# EAGLE design 01 Raspberry Hat 7 Schematic (EAGLE 9.1.1)

## Sheet 1 of 8: Motor controllers
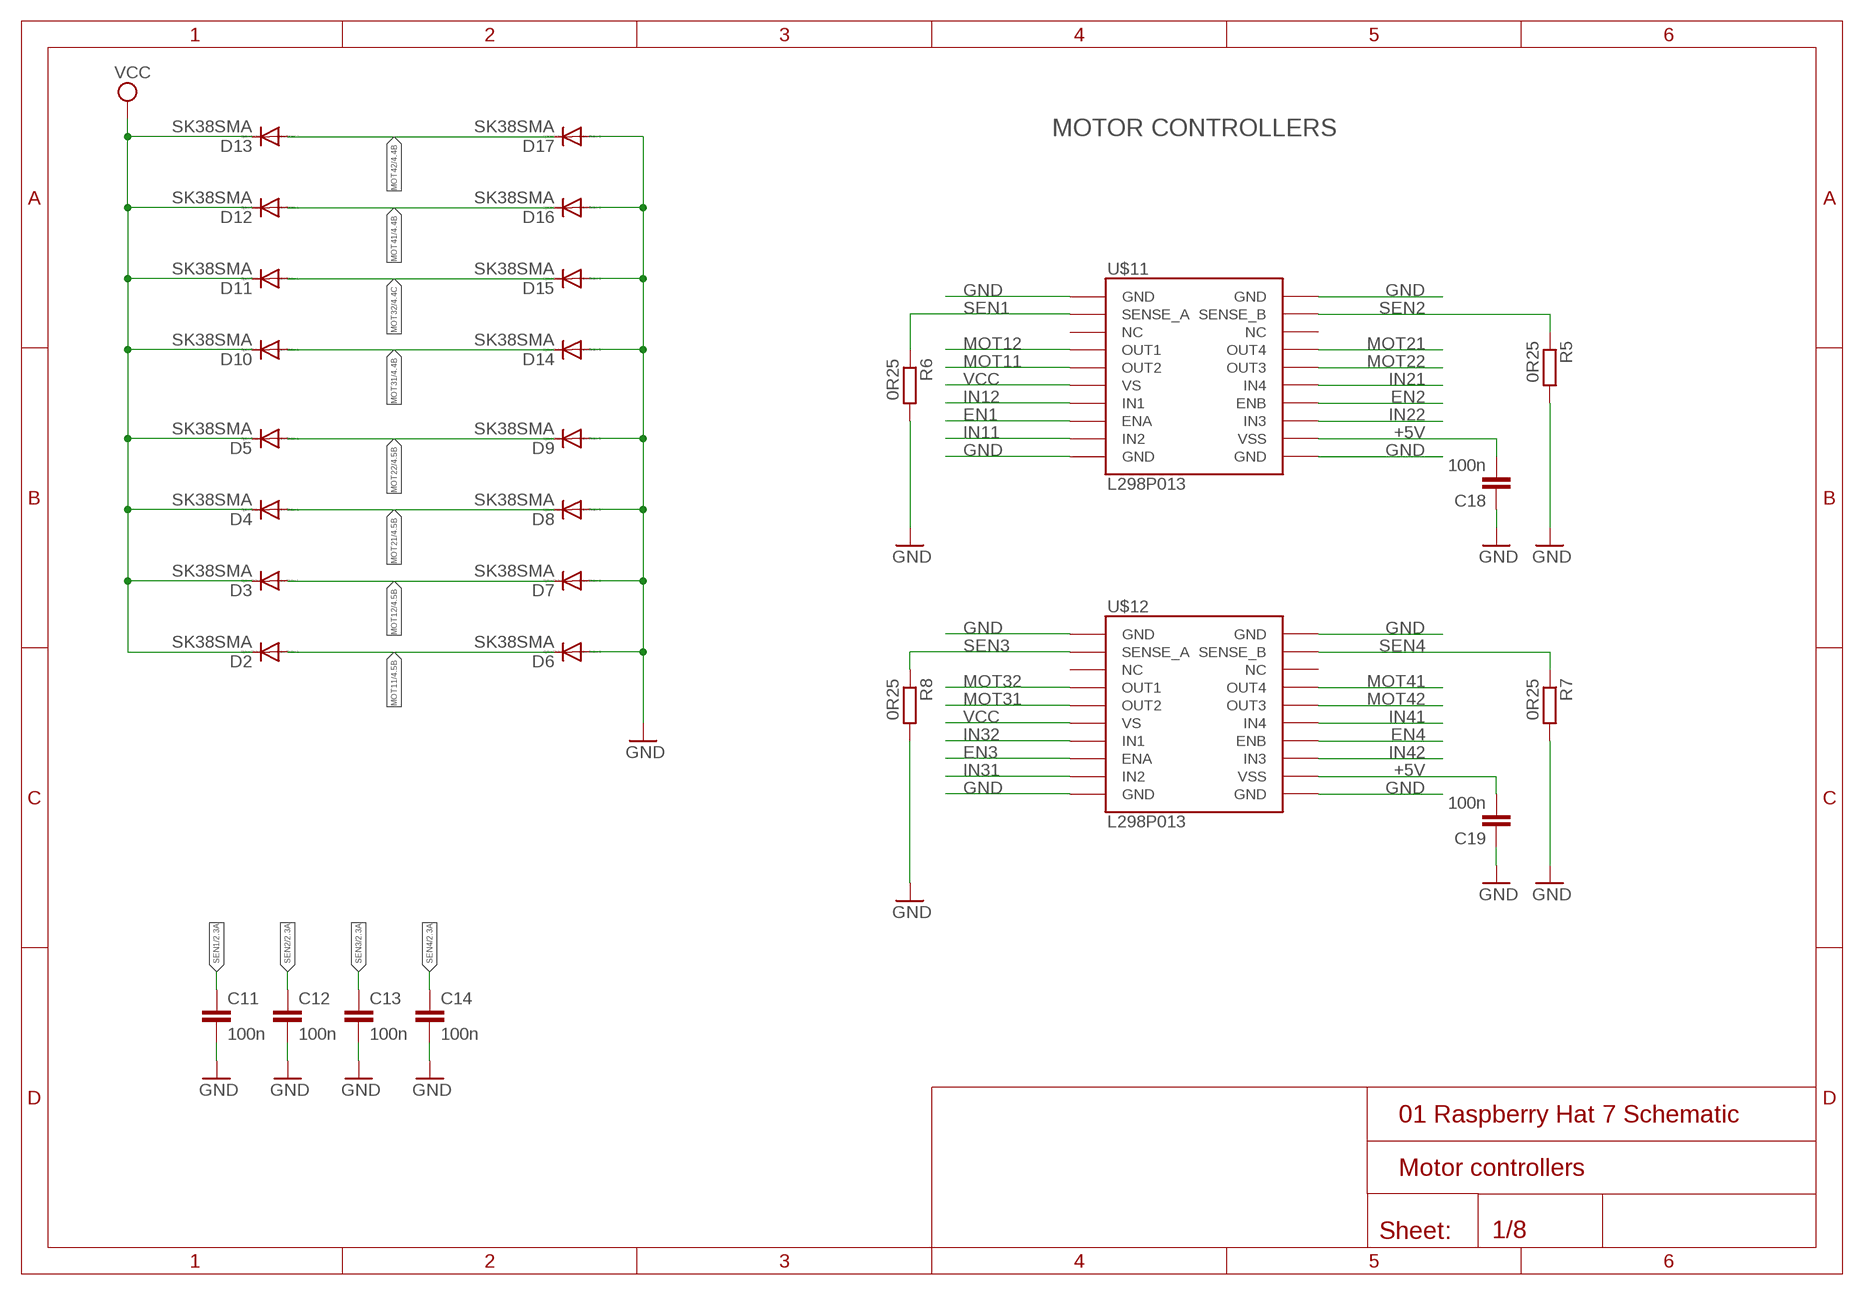
[diagram p0: schematic, sheet 1]

### Parts
C11  100n  C-EUC0603K  [C0603K]
C12  100n  C-EUC0603K  [C0603K]
C13  100n  C-EUC0603K  [C0603K]
C14  100n  C-EUC0603K  [C0603K]
C18  100n  C-EUC0603K  [C0603K]
C19  100n  C-EUC0603K  [C0603K]
D2  SK38SMA  DIODE-SOD123  [SOD123]
D3  SK38SMA  DIODE-SOD123  [SOD123]
D4  SK38SMA  DIODE-SOD123  [SOD123]
D5  SK38SMA  DIODE-SOD123  [SOD123]
D6  SK38SMA  DIODE-SOD123  [SOD123]
D7  SK38SMA  DIODE-SOD123  [SOD123]
D8  SK38SMA  DIODE-SOD123  [SOD123]
D9  SK38SMA  DIODE-SOD123  [SOD123]
D10  SK38SMA  DIODE-SOD123  [SOD123]
D11  SK38SMA  DIODE-SOD123  [SOD123]
D12  SK38SMA  DIODE-SOD123  [SOD123]
D13  SK38SMA  DIODE-SOD123  [SOD123]
D14  SK38SMA  DIODE-SOD123  [SOD123]
D15  SK38SMA  DIODE-SOD123  [SOD123]
D16  SK38SMA  DIODE-SOD123  [SOD123]
D17  SK38SMA  DIODE-SOD123  [SOD123]
R5  0R25  R-EU_R2512  [R2512]
R6  0R25  R-EU_R2512  [R2512]
R7  0R25  R-EU_R2512  [R2512]
R8  0R25  R-EU_R2512  [R2512]
U$11  L298P013  L298_BRIDGE_DRIVER  [POWERSO20]
U$12  L298P013  L298_BRIDGE_DRIVER  [POWERSO20]

### Nets
+5V: C18.2 C19.2 U$11.12(VSS) U$12.12(VSS) ; also sheet 3,4,5,6
EN1: U$11.8(ENA) ; also sheet 5
EN2: U$11.14(ENB) ; also sheet 5
EN3: U$12.8(ENA) ; also sheet 5
EN4: U$12.14(ENB) ; also sheet 5
GND: C11.2 C12.2 C13.2 C14.2 C18.1 C19.1 D6.A D7.A D8.A D9.A D14.A D15.A D16.A D17.A R5.2 R6.2 R7.2 R8.2 U$11.1(GND) U$11.10(GND) U$11.11(GND) U$11.20(GND) U$12.1(GND) U$12.10(GND) U$12.11(GND) U$12.20(GND) ; also sheet 2,3,4,5,6,7
IN11: U$11.9(IN2) ; also sheet 5
IN12: U$11.7(IN1) ; also sheet 5
IN21: U$11.15(IN4) ; also sheet 5
IN22: U$11.13(IN3) ; also sheet 5
IN31: U$12.9(IN2) ; also sheet 5
IN32: U$12.7(IN1) ; also sheet 5
IN41: U$12.15(IN4) ; also sheet 5
IN42: U$12.13(IN3) ; also sheet 5
MOT11: D2.A D6.C U$11.5(OUT2) ; also sheet 4
MOT12: D3.A D7.C U$11.4(OUT1) ; also sheet 4
MOT21: D4.A D8.C U$11.17(OUT4) ; also sheet 4
MOT22: D5.A D9.C U$11.16(OUT3) ; also sheet 4
MOT31: D10.A D14.C U$12.5(OUT2) ; also sheet 4
MOT32: D11.A D15.C U$12.4(OUT1) ; also sheet 4
MOT41: D12.A D16.C U$12.17(OUT4) ; also sheet 4
MOT42: D13.A D17.C U$12.16(OUT3) ; also sheet 4
SEN1: C11.1 R6.1 U$11.2(SENSE_A) ; also sheet 2
SEN2: C12.1 R5.1 U$11.19(SENSE_B) ; also sheet 2
SEN3: C13.1 R8.1 U$12.2(SENSE_A) ; also sheet 2
SEN4: C14.1 R7.1 U$12.19(SENSE_B) ; also sheet 2
VCC: D2.C D3.C D4.C D5.C D10.C D11.C D12.C D13.C U$11.6(VS) U$12.6(VS) ; also sheet 3,4
Unconnected: U$11.3(NC) U$11.18(NC) U$12.3(NC) U$12.18(NC)

### Notes on the sheet
- MOTOR CONTROLLERS

## Sheet 2 of 8: Microcontroller connections
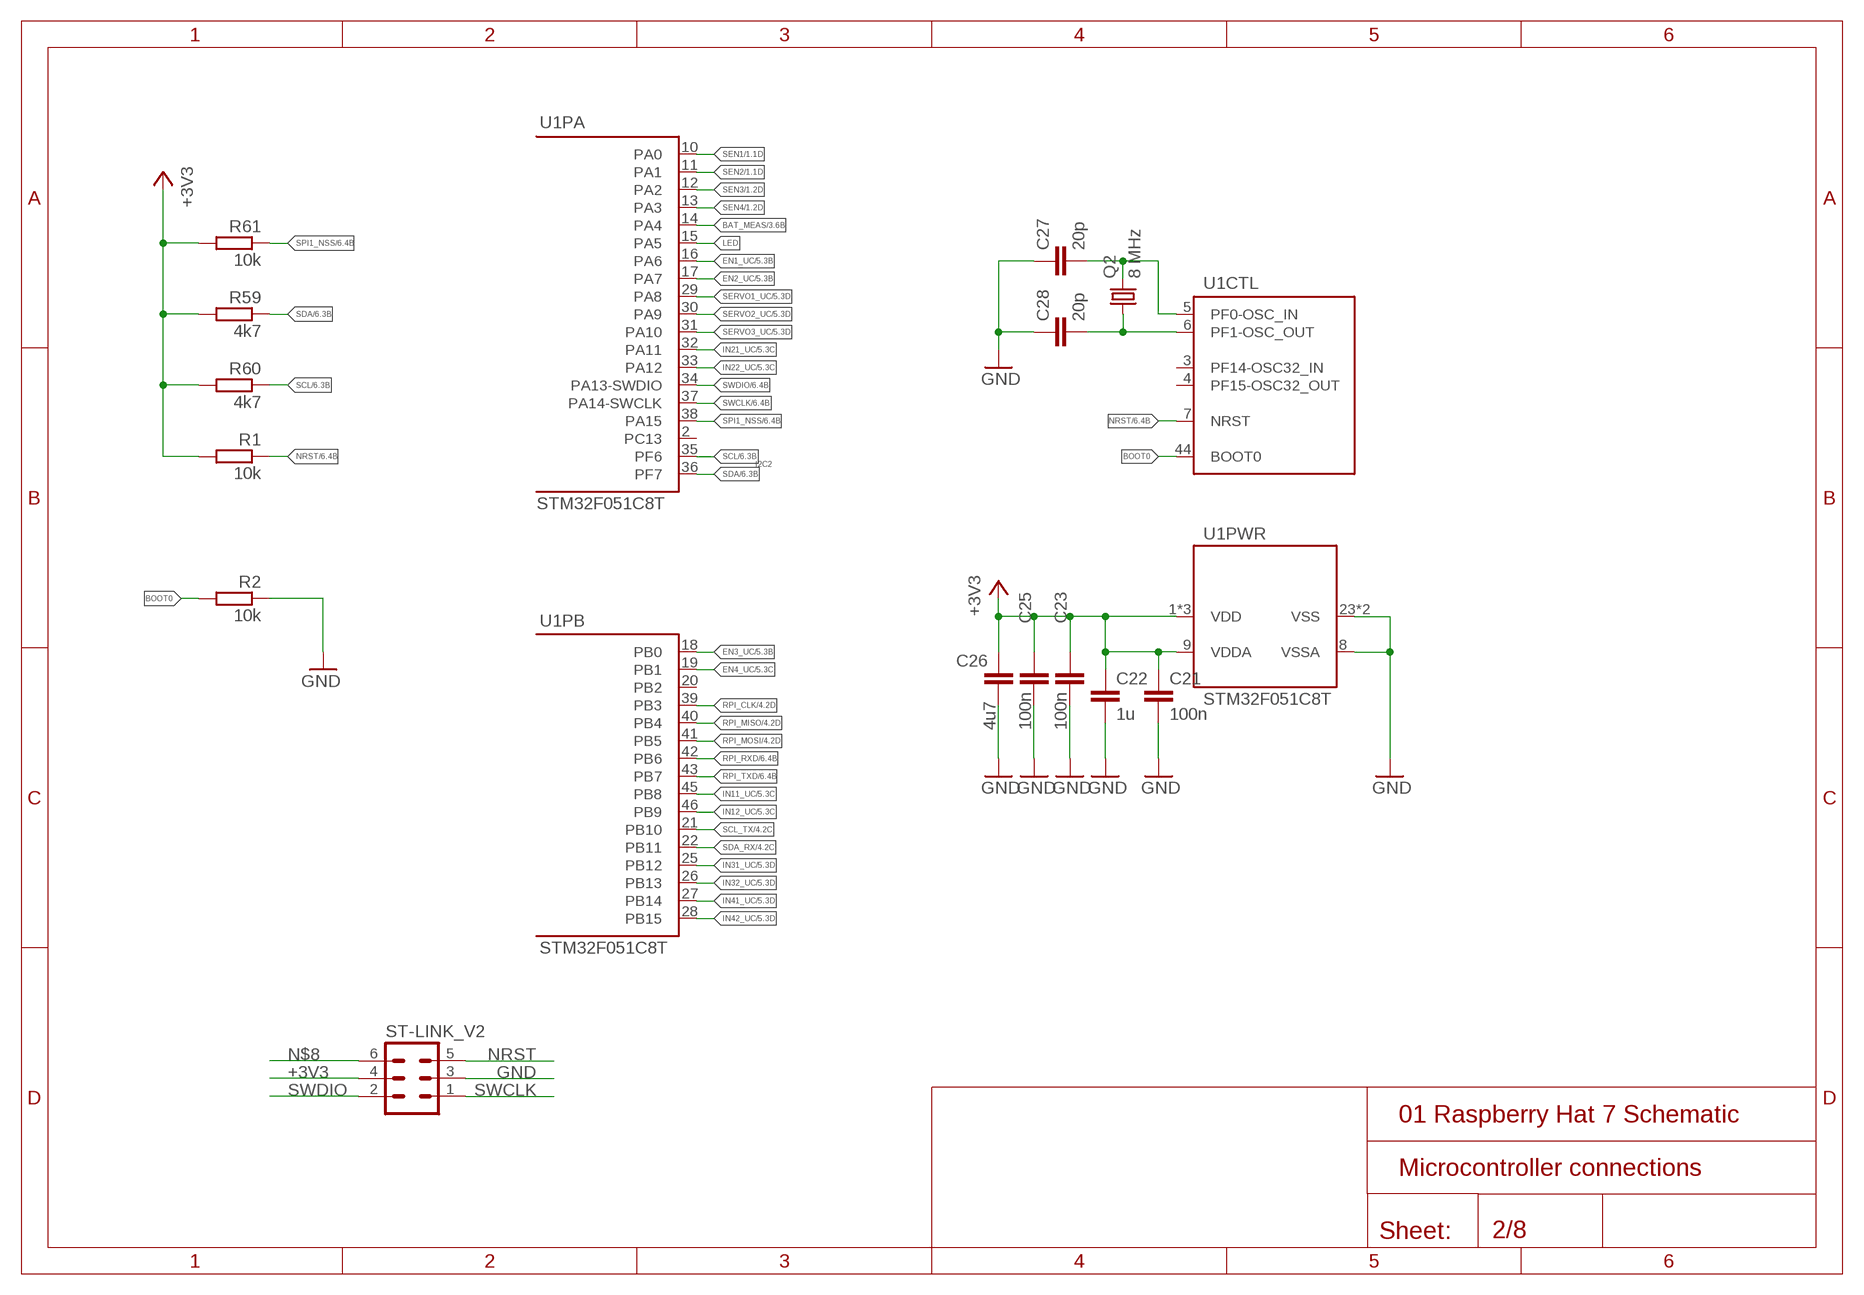
[diagram p1: schematic, sheet 2]

### Parts
C21  100n  C-EUC0603K  [C0603K]
C22  1u  C-EUC0603K  [C0603K]
C23  100n  C-EUC0603K  [C0603K]
C25  100n  C-EUC0603K  [C0603K]
C26  4u7  C-EUC0603K  [C0603K]
C27  20p  C-EUC0603K  [C0603K]
C28  20p  C-EUC0603K  [C0603K]
Q2  8 MHz  CRYSTALHC49UP  [HC49UP]
R1  10k  R-EU_R0603  [R0603]
R2  10k  R-EU_R0603  [R0603]
R59  4k7  R-EU_R0603  [R0603]
R60  4k7  R-EU_R0603  [R0603]
R61  10k  R-EU_R0603  [R0603]
ST-LINK_V2  ML6  [ML6]
U1  STM32F051C8T  [LQFP48]

### Nets
+3V3: C21.1 C22.1 C23.1 C25.1 C26.1 R1.2 R59.2 R60.2 R61.2 ST-LINK_V2.4 U1.1(PWR:VDD) U1.9(PWR:VDDA) U1.24(PWR:VDD) U1.48(PWR:VDD) ; also sheet 5,6,7
BAT_MEAS: U1.14(PA:PA4) ; also sheet 3
BOOT0: R2.2 U1.44(CTL:BOOT0)
EN1_UC: U1.16(PA:PA6) ; also sheet 5
EN2_UC: U1.17(PA:PA7) ; also sheet 5
EN3_UC: U1.18(PB:PB0) ; also sheet 5
EN4_UC: U1.19(PB:PB1) ; also sheet 5
GND: C21.2 C22.2 C23.2 C25.2 C26.2 C27.1 C28.1 R2.1 ST-LINK_V2.3 U1.8(PWR:VSSA) U1.23(PWR:VSS) U1.47(PWR:VSS) ; also sheet 1,3,4,5,6,7
IN11_UC: U1.45(PB:PB8) ; also sheet 5
IN12_UC: U1.46(PB:PB9) ; also sheet 5
IN21_UC: U1.32(PA:PA11) ; also sheet 5
IN22_UC: U1.33(PA:PA12) ; also sheet 5
IN31_UC: U1.25(PB:PB12) ; also sheet 5
IN32_UC: U1.26(PB:PB13) ; also sheet 5
IN41_UC: U1.27(PB:PB14) ; also sheet 5
IN42_UC: U1.28(PB:PB15) ; also sheet 5
LED: U1.15(PA:PA5)
N$8: ST-LINK_V2.6
N$28: C28.2 Q2.1 U1.6(CTL:PF1-OSC_OUT)
N$29: C27.2 Q2.2 U1.5(CTL:PF0-OSC_IN)
NRST: R1.1 ST-LINK_V2.5 U1.7(CTL:NRST) ; also sheet 6
RPI_CLK: U1.39(PB:PB3) ; also sheet 4,6
RPI_MISO: U1.40(PB:PB4) ; also sheet 4,6
RPI_MOSI: U1.41(PB:PB5) ; also sheet 4,6
RPI_RXD: U1.42(PB:PB6) ; also sheet 6
RPI_TXD: U1.43(PB:PB7) ; also sheet 6
SCL: R60.1 U1.35(PA:PF6) ; also sheet 6,7
SCL_TX: U1.21(PB:PB10) ; also sheet 4
SDA: R59.1 U1.36(PA:PF7) ; also sheet 6,7
SDA_RX: U1.22(PB:PB11) ; also sheet 4
SEN1: U1.10(PA:PA0) ; also sheet 1
SEN2: U1.11(PA:PA1) ; also sheet 1
SEN3: U1.12(PA:PA2) ; also sheet 1
SEN4: U1.13(PA:PA3) ; also sheet 1
SERVO1_UC: U1.29(PA:PA8) ; also sheet 5
SERVO2_UC: U1.30(PA:PA9) ; also sheet 5
SERVO3_UC: U1.31(PA:PA10) ; also sheet 5
SPI1_NSS: R61.1 U1.38(PA:PA15) ; also sheet 6
SWCLK: ST-LINK_V2.1 U1.37(PA:PA14-SWCLK) ; also sheet 6
SWDIO: ST-LINK_V2.2 U1.34(PA:PA13-SWDIO) ; also sheet 6
Unconnected: U1.2(PA:PC13) U1.3(CTL:PF14-OSC32_IN) U1.4(CTL:PF15-OSC32_OUT) U1.20(PB:PB2)

### Notes on the sheet
- I2C2

## Sheet 3 of 8: Power supply
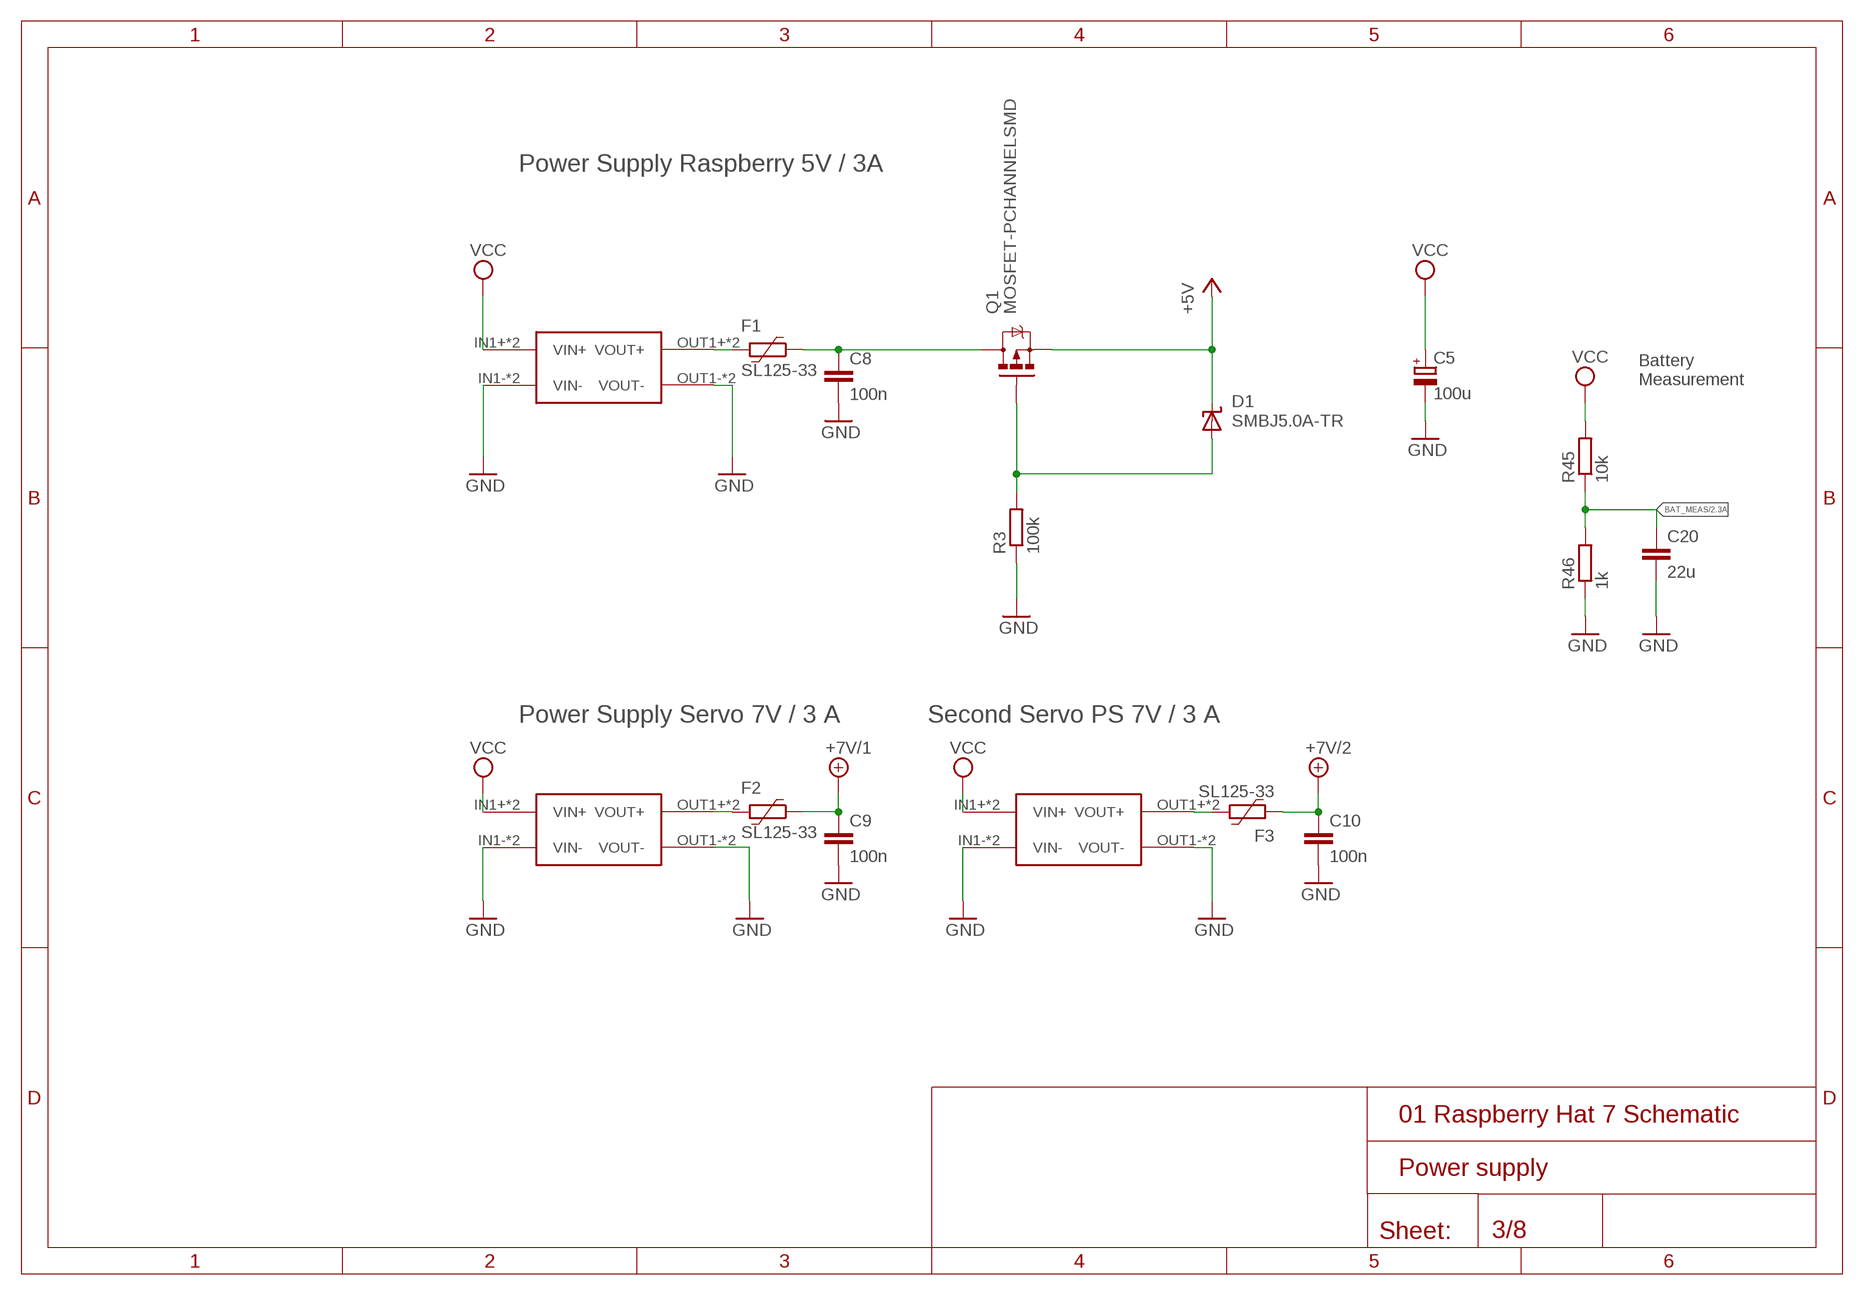
[diagram p2: schematic, sheet 3]

### Parts
C5  100u  CPOL-EU153CLV-0807  [153CLV-0807]
C8  100n  C-EUC0603K  [C0603K]
C9  100n  C-EUC0603K  [C0603K]
C10  100n  C-EUC0603K  [C0603K]
C20  22u  C-EUC0603K  [C0603K]
D1  SMBJ5.0A-TR  SUPPRESSOR-SMBJ  [SMBJ]
F1  SL125-33  2920L050  [2920L]
F2  SL125-33  2920L050  [2920L]
F3  SL125-33  2920L050  [2920L]
Q1  MOSFET-PCHANNELSMD  [SOT23-3]
R3  100k  R-EU_R0603  [R0603]
R45  10k  R-EU_R0603  [R0603]
R46  1k  R-EU_R0603  [R0603]
U$1  MP1584  [DC-BRICK]
U$2  MP1584  [DC-BRICK]
U$3  MP1584  [DC-BRICK]

### Nets
5V_NOT_TRIMMED: C8.1 F1.1 Q1.3(D)
+5V: D1.C Q1.2(S) ; also sheet 1,4,5,6
+5V_RAW: F1.2 U$3.OUT1+(VOUT+) U$3.OUT2+(VOUT+)
+7V/1: C9.1 F2.1 ; also sheet 4
+7V/1_RAW: F2.2 U$2.OUT1+(VOUT+) U$2.OUT2+(VOUT+)
+7V/2: C10.1 F3.2 ; also sheet 4
+7V/2_RAW: F3.1 U$1.OUT1+(VOUT+) U$1.OUT2+(VOUT+)
BAT_MEAS: C20.1 R45.1 R46.2 ; also sheet 2
D1-R3: D1.A Q1.1(G) R3.2
GND: C5.- C8.2 C9.2 C10.2 C20.2 R3.1 R46.1 U$1.IN1-(VIN-) U$1.IN2-(VIN-) U$1.OUT1-(VOUT-) U$1.OUT2-(VOUT-) U$2.IN1-(VIN-) U$2.IN2-(VIN-) U$2.OUT1-(VOUT-) U$2.OUT2-(VOUT-) U$3.IN1-(VIN-) U$3.IN2-(VIN-) U$3.OUT1-(VOUT-) U$3.OUT2-(VOUT-) ; also sheet 1,2,4,5,6,7
VCC: C5.+ R45.2 U$1.IN1+(VIN+) U$1.IN2+(VIN+) U$2.IN1+(VIN+) U$2.IN2+(VIN+) U$3.IN1+(VIN+) U$3.IN2+(VIN+) ; also sheet 1,4

### Notes on the sheet
- Power Supply Raspberry 5V / 3A
- Battery
  Measurement
- Power Supply Servo 7V / 3 A | Second Servo PS 7V / 3 A

## Sheet 4 of 8: Connectors
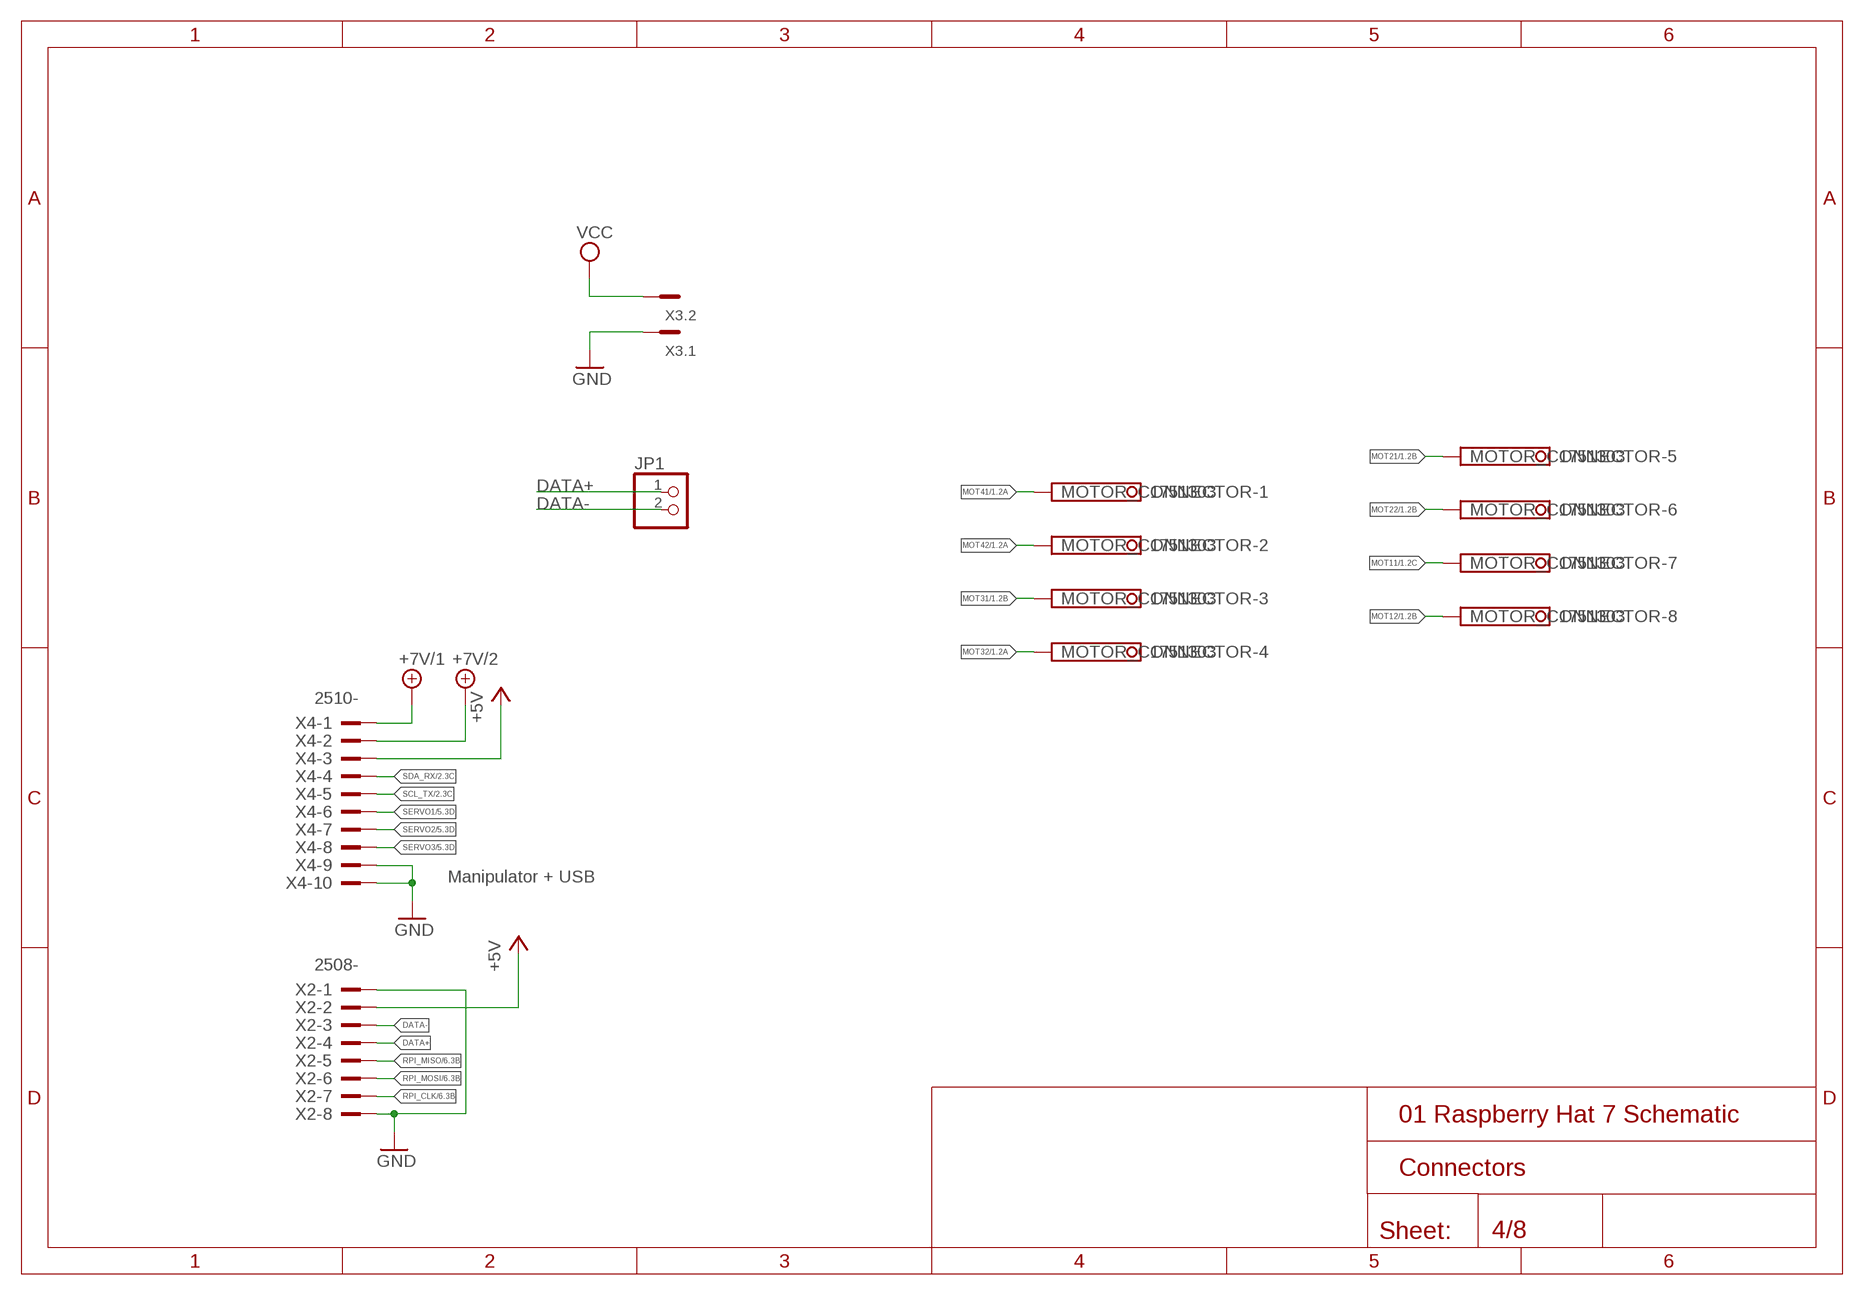
[diagram p3: schematic, sheet 4]

### Parts
JP1  PINHD-1X2  [1X02]
MOTOR_CONNECTOR  1751303  [1751303]
X2  2508-  [PAK100/2500-10]
X3  MC2  [MC2]
X4  2510-  [PAK100/2500-10]

### Nets
+5V: X2.2 X4.3 ; also sheet 1,3,5,6
+7V/1: X4.1 ; also sheet 3
+7V/2: X4.2 ; also sheet 3
DATA+: JP1.1 X2.4
DATA-: JP1.2 X2.3
GND: X2.1 X2.8 X3.1 X4.9 X4.10 ; also sheet 1,2,3,5,6,7
MOT11: MOTOR_CONNECTOR.7 ; also sheet 1
MOT12: MOTOR_CONNECTOR.8 ; also sheet 1
MOT21: MOTOR_CONNECTOR.5 ; also sheet 1
MOT22: MOTOR_CONNECTOR.6 ; also sheet 1
MOT31: MOTOR_CONNECTOR.3 ; also sheet 1
MOT32: MOTOR_CONNECTOR.4 ; also sheet 1
MOT41: MOTOR_CONNECTOR.1 ; also sheet 1
MOT42: MOTOR_CONNECTOR.2 ; also sheet 1
RPI_CLK: X2.7 ; also sheet 2,6
RPI_MISO: X2.5 ; also sheet 2,6
RPI_MOSI: X2.6 ; also sheet 2,6
SCL_TX: X4.5 ; also sheet 2
SDA_RX: X4.4 ; also sheet 2
SERVO1: X4.6 ; also sheet 5
SERVO2: X4.7 ; also sheet 5
SERVO3: X4.8 ; also sheet 5
VCC: X3.2 ; also sheet 1,3

### Notes on the sheet
- Manipulator + USB

## Sheet 5 of 8: Voltage level translators
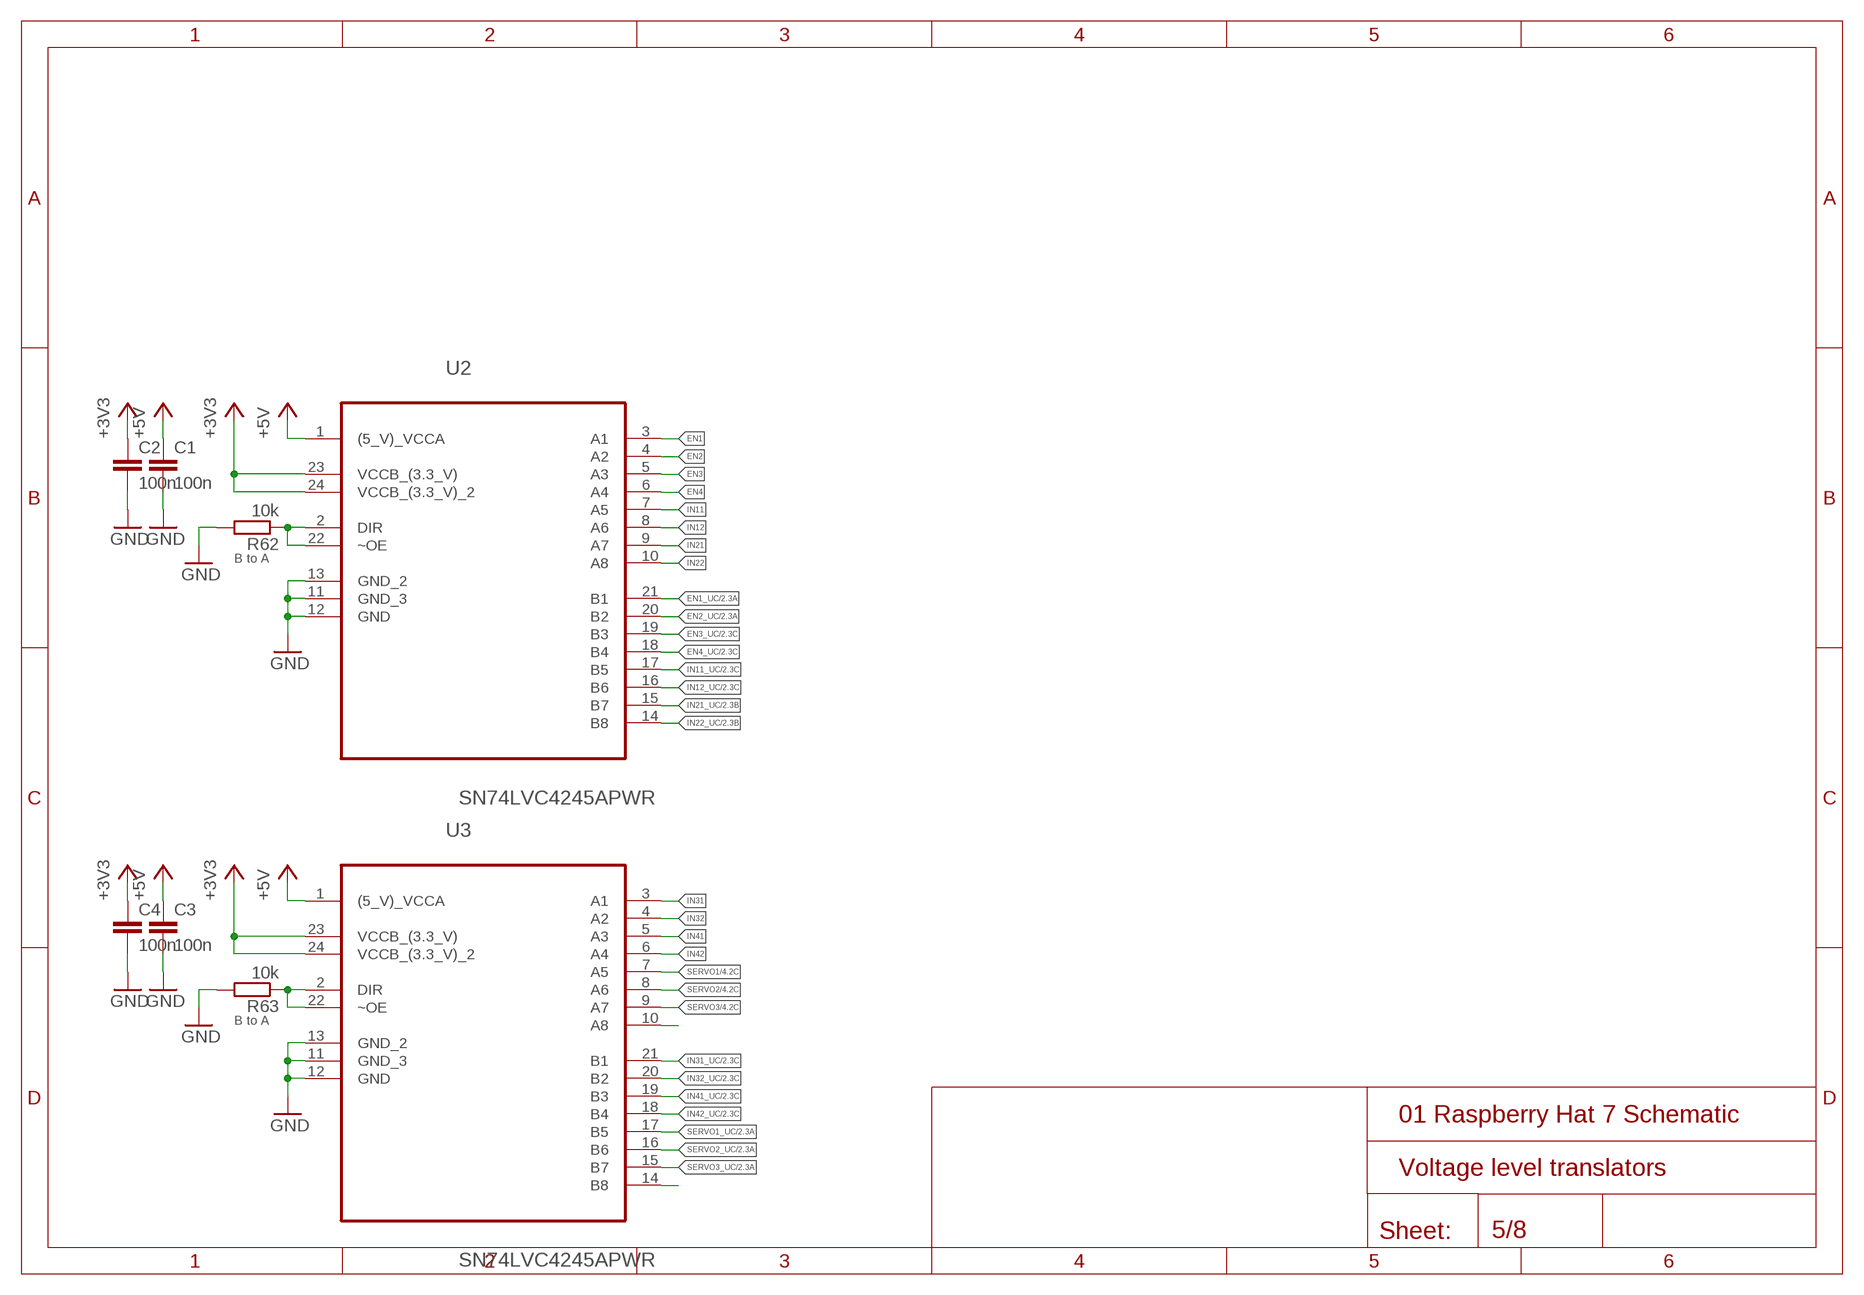
[diagram p4: schematic, sheet 5]

### Parts
C1  100n  C-EUC0603K  [C0603K]
C2  100n  C-EUC0603K  [C0603K]
C3  100n  C-EUC0603K  [C0603K]
C4  100n  C-EUC0603K  [C0603K]
R62  10k  R-EU_R0603  [R0603]
R63  10k  R-EU_R0603  [R0603]
U2  SN74LVC4245APWR  [SOP65P640X120-24N]
U3  SN74LVC4245APWR  [SOP65P640X120-24N]

### Nets
+3V3: C2.1 C4.1 U2.23(VCCB_(3.3_V)) U2.24(VCCB_(3.3_V)_2) U3.23(VCCB_(3.3_V)) U3.24(VCCB_(3.3_V)_2) ; also sheet 2,6,7
+5V: C1.1 C3.1 U2.1((5_V)_VCCA) U3.1((5_V)_VCCA) ; also sheet 1,3,4,6
EN1: U2.3(A1) ; also sheet 1
EN1_UC: U2.21(B1) ; also sheet 2
EN2: U2.4(A2) ; also sheet 1
EN2_UC: U2.20(B2) ; also sheet 2
EN3: U2.5(A3) ; also sheet 1
EN3_UC: U2.19(B3) ; also sheet 2
EN4: U2.6(A4) ; also sheet 1
EN4_UC: U2.18(B4) ; also sheet 2
GND: C1.2 C2.2 C3.2 C4.2 R62.2 R63.2 U2.11(GND_3) U2.12(GND) U2.13(GND_2) U3.11(GND_3) U3.12(GND) U3.13(GND_2) ; also sheet 1,2,3,4,6,7
IN11: U2.7(A5) ; also sheet 1
IN11_UC: U2.17(B5) ; also sheet 2
IN12: U2.8(A6) ; also sheet 1
IN12_UC: U2.16(B6) ; also sheet 2
IN21: U2.9(A7) ; also sheet 1
IN21_UC: U2.15(B7) ; also sheet 2
IN22: U2.10(A8) ; also sheet 1
IN22_UC: U2.14(B8) ; also sheet 2
IN31: U3.3(A1) ; also sheet 1
IN31_UC: U3.21(B1) ; also sheet 2
IN32: U3.4(A2) ; also sheet 1
IN32_UC: U3.20(B2) ; also sheet 2
IN41: U3.5(A3) ; also sheet 1
IN41_UC: U3.19(B3) ; also sheet 2
IN42: U3.6(A4) ; also sheet 1
IN42_UC: U3.18(B4) ; also sheet 2
N$1: R62.1 U2.2(DIR) U2.22(~OE)
N$2: R63.1 U3.2(DIR) U3.22(~OE)
N$3: U3.10(A8)
N$4: U3.14(B8)
SERVO1: U3.7(A5) ; also sheet 4
SERVO1_UC: U3.17(B5) ; also sheet 2
SERVO2: U3.8(A6) ; also sheet 4
SERVO2_UC: U3.16(B6) ; also sheet 2
SERVO3: U3.9(A7) ; also sheet 4
SERVO3_UC: U3.15(B7) ; also sheet 2

### Notes on the sheet
- B to A
- B to A

## Sheet 6 of 8: RPi connections
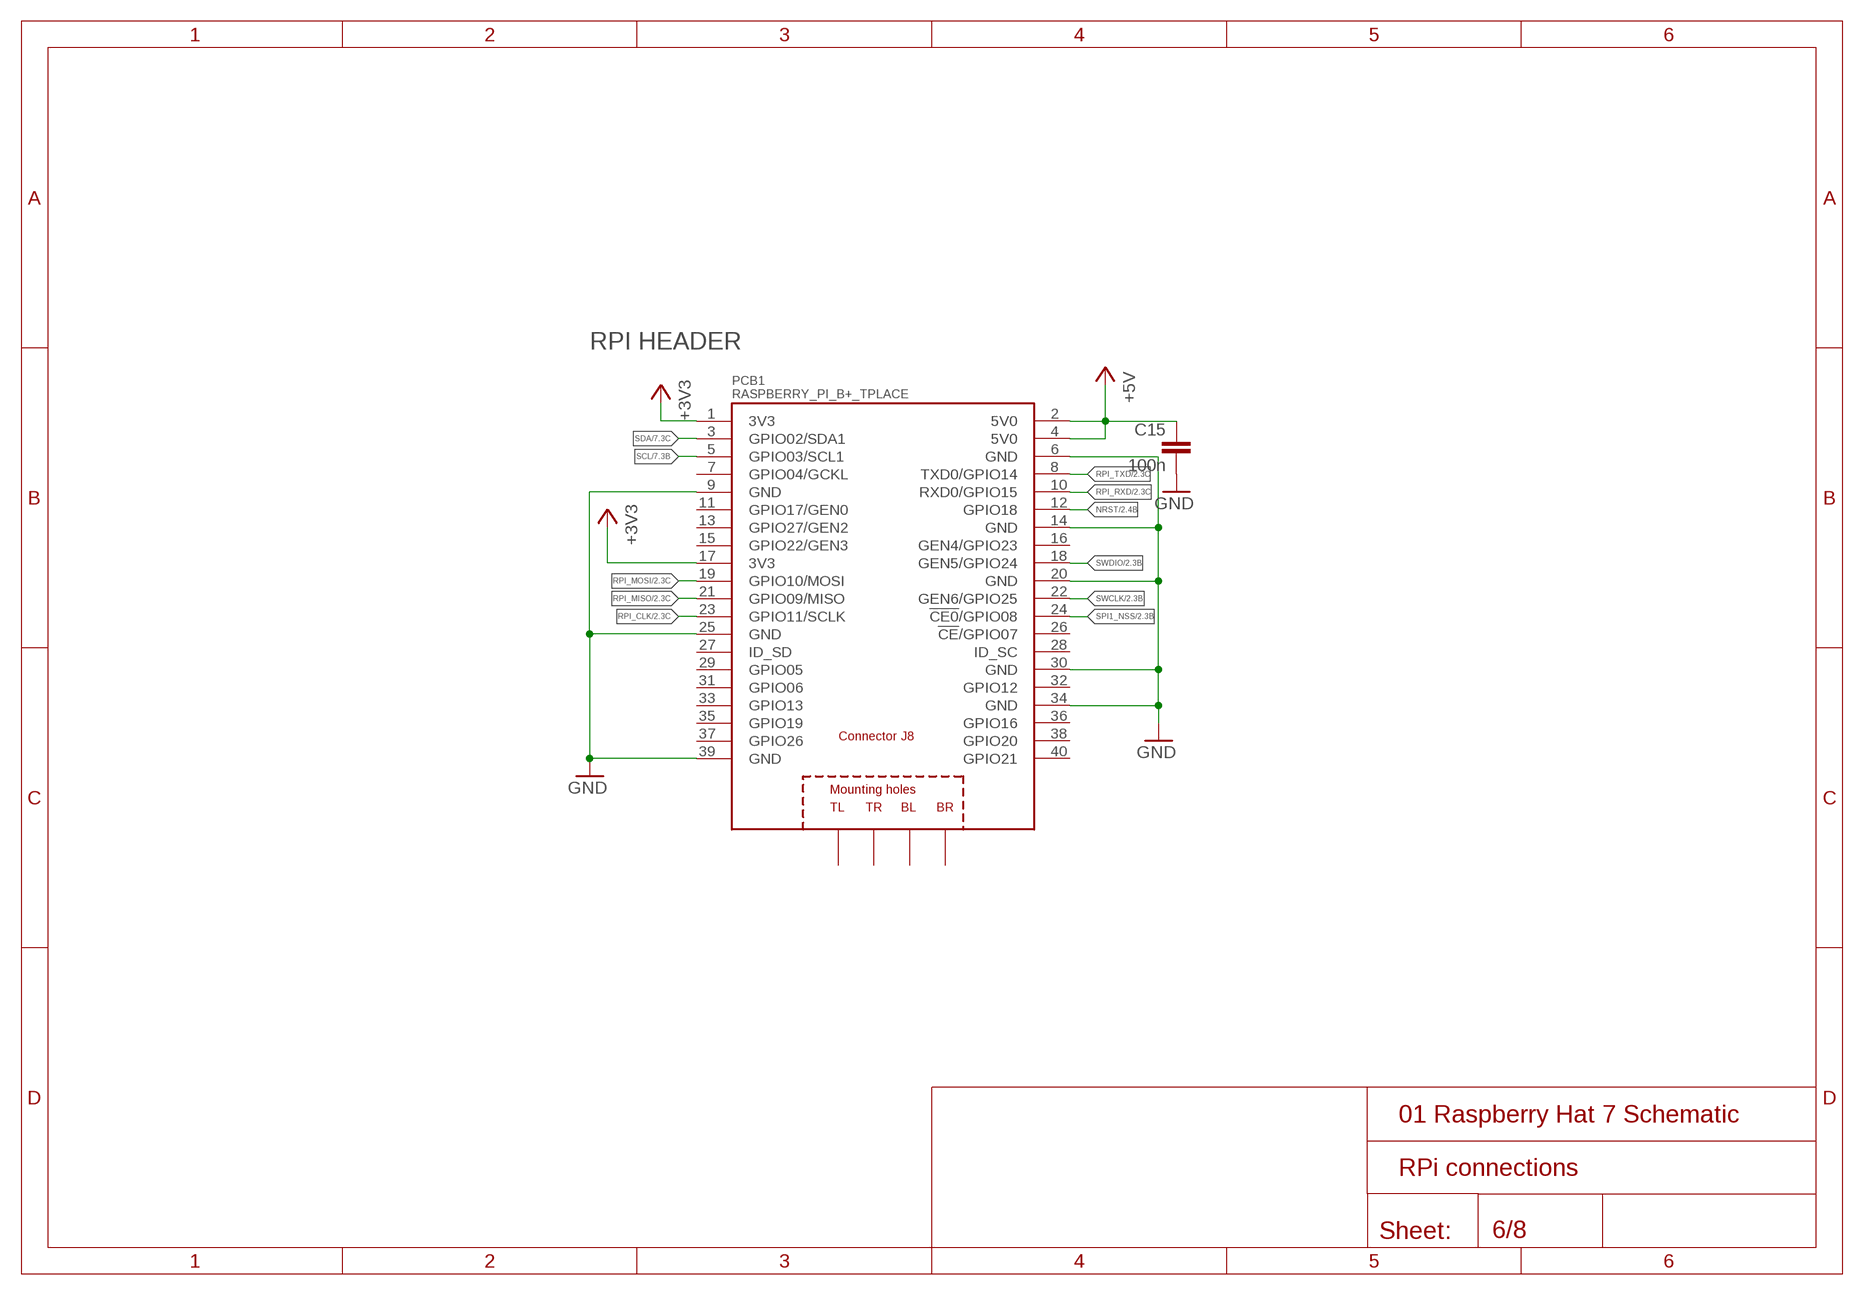
[diagram p5: schematic, sheet 6]

### Parts
C15  100n  C-EUC0603K  [C0603K]
PCB1  RASPBERRY_PI_B+_TPLACE  [RASPBERRY_PI_BPLUS_TPLACE]

### Nets
+3V3: PCB1.1(3V3) PCB1.17(3V3) ; also sheet 2,5,7
+5V: C15.1 PCB1.2(5V0) PCB1.4(5V0) ; also sheet 1,3,4,5
GND: C15.2 PCB1.6(GND) PCB1.9(GND) PCB1.14(GND) PCB1.20(GND) PCB1.25(GND) PCB1.30(GND) PCB1.34(GND) PCB1.39(GND) ; also sheet 1,2,3,4,5,7
NRST: PCB1.12(GPIO18) ; also sheet 2
RPI_CLK: PCB1.23(GPIO11/SCLK) ; also sheet 2,4
RPI_MISO: PCB1.21(GPIO09/MISO) ; also sheet 2,4
RPI_MOSI: PCB1.19(GPIO10/MOSI) ; also sheet 2,4
RPI_RXD: PCB1.10(RXD0/GPIO15) ; also sheet 2
RPI_TXD: PCB1.8(TXD0/GPIO14) ; also sheet 2
SCL: PCB1.5(GPIO03/SCL1) ; also sheet 2,7
SDA: PCB1.3(GPIO02/SDA1) ; also sheet 2,7
SPI1_NSS: PCB1.24(!CE0!/GPIO08) ; also sheet 2
SWCLK: PCB1.22(GEN6/GPIO25) ; also sheet 2
SWDIO: PCB1.18(GEN5/GPIO24) ; also sheet 2
Unconnected: PCB1.7(GPIO04/GCKL) PCB1.11(GPIO17/GEN0) PCB1.13(GPIO27/GEN2) PCB1.15(GPIO22/GEN3) PCB1.16(GEN4/GPIO23) PCB1.26(!CE!/GPIO07) PCB1.27(ID_SD) PCB1.28(ID_SC) PCB1.29(GPIO05) PCB1.31(GPIO06) PCB1.32(GPIO12) PCB1.33(GPIO13) PCB1.35(GPIO19) PCB1.36(GPIO16) PCB1.37(GPIO26) PCB1.38(GPIO20) PCB1.40(GPIO21) PCB1.PE_BL(BL) PCB1.PE_BR(BR) PCB1.PE_TL(TL) PCB1.PE_TR(TR)

### Notes on the sheet
- RPI HEADER

## Sheet 7 of 8: EEPROM
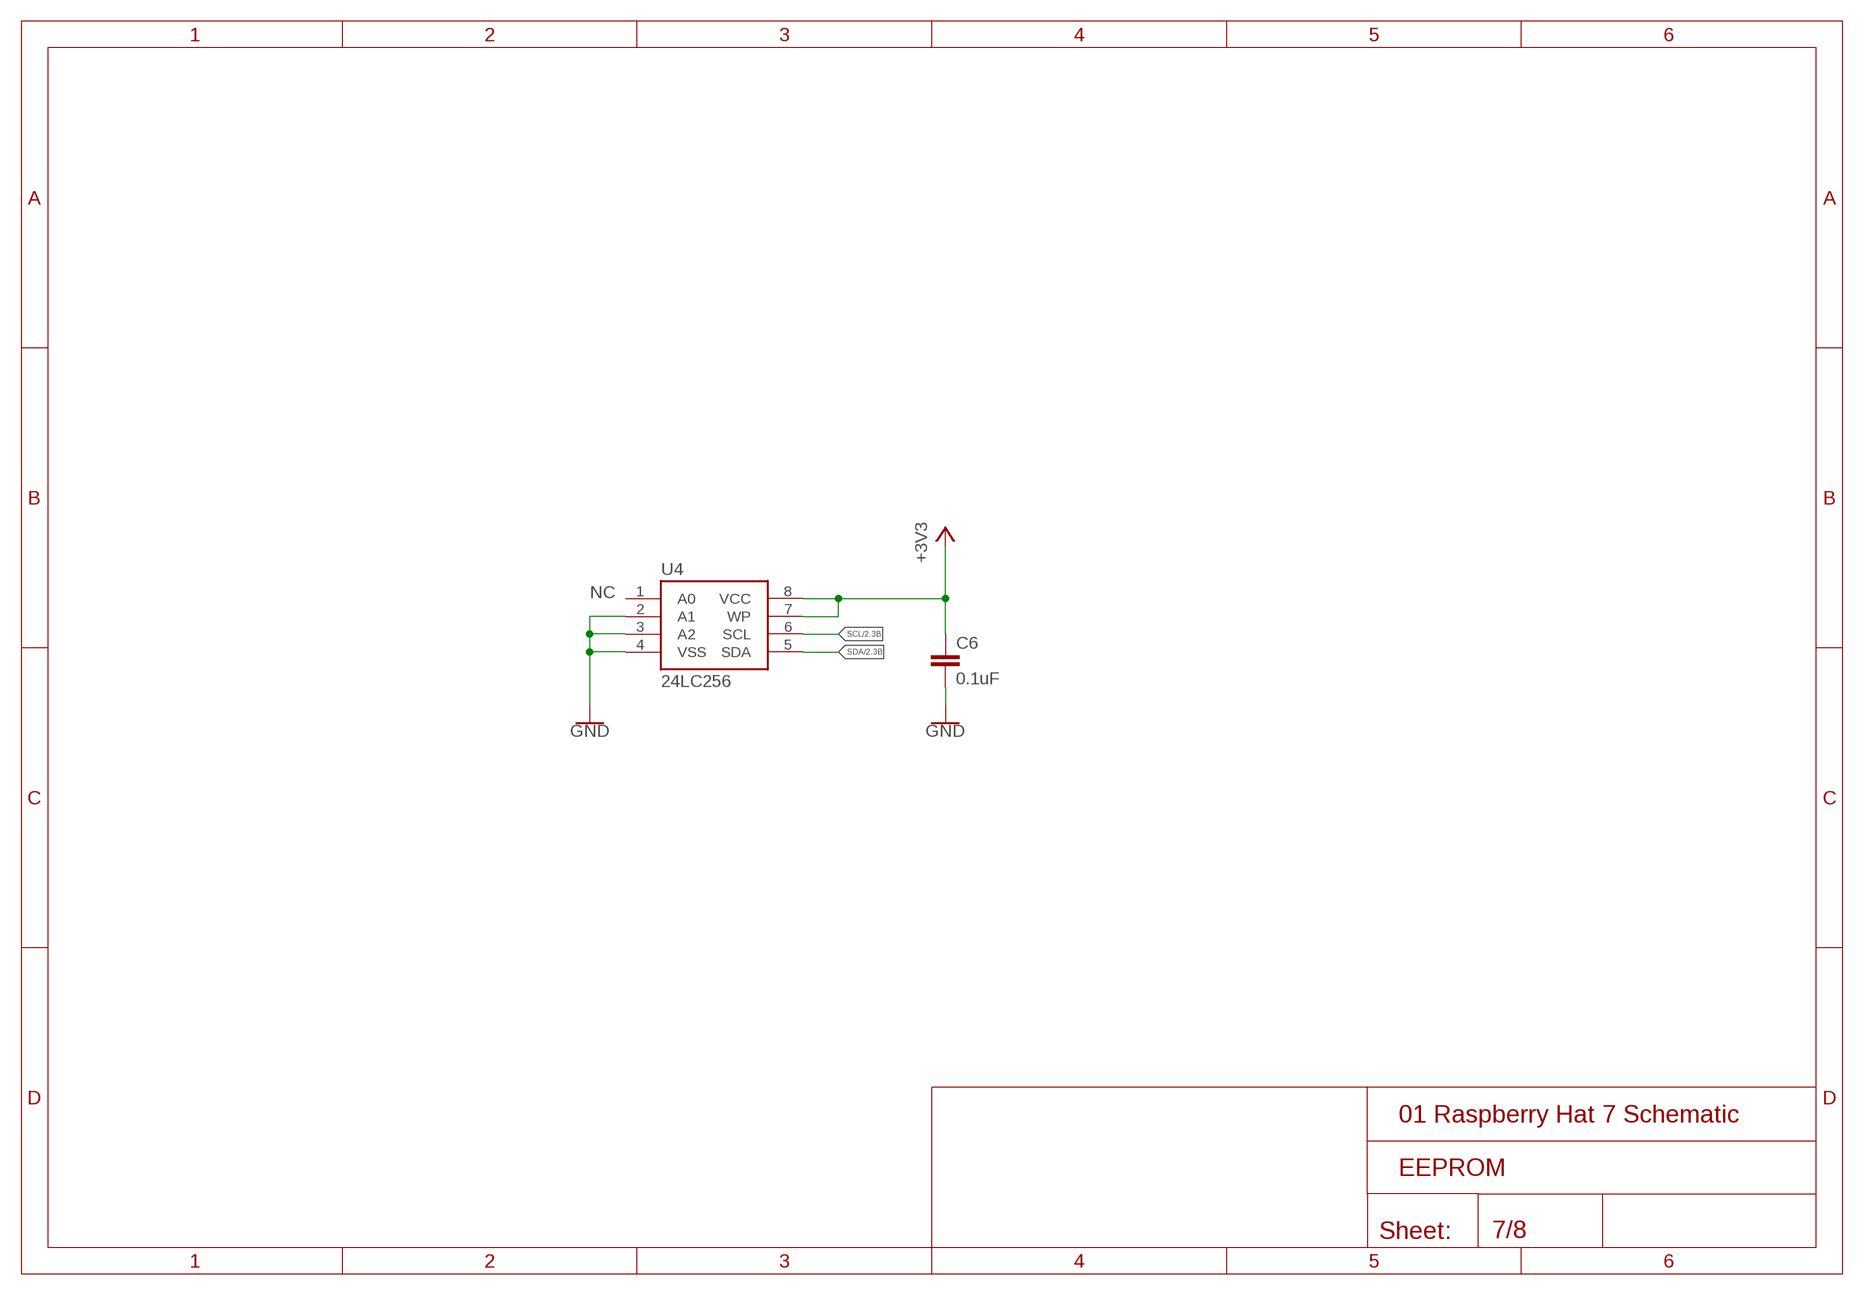
[diagram p6: schematic, sheet 7]

### Parts
C6  0.1uF  C-EUC0603  [C0603]
U4  24LC256  EEPROM-I2CSMD  [SO08]

### Nets
+3V3: C6.1 U4.7(WP) U4.8(VCC) ; also sheet 2,5,6
GND: C6.2 U4.2(A1) U4.3(A2) U4.4(VSS) ; also sheet 1,2,3,4,5,6
SCL: U4.6(SCL) ; also sheet 2,6
SDA: U4.5(SDA) ; also sheet 2,6
Unconnected: U4.1(A0)

### Notes on the sheet
- NC

## Sheet 8 of 8: TEST POINTS
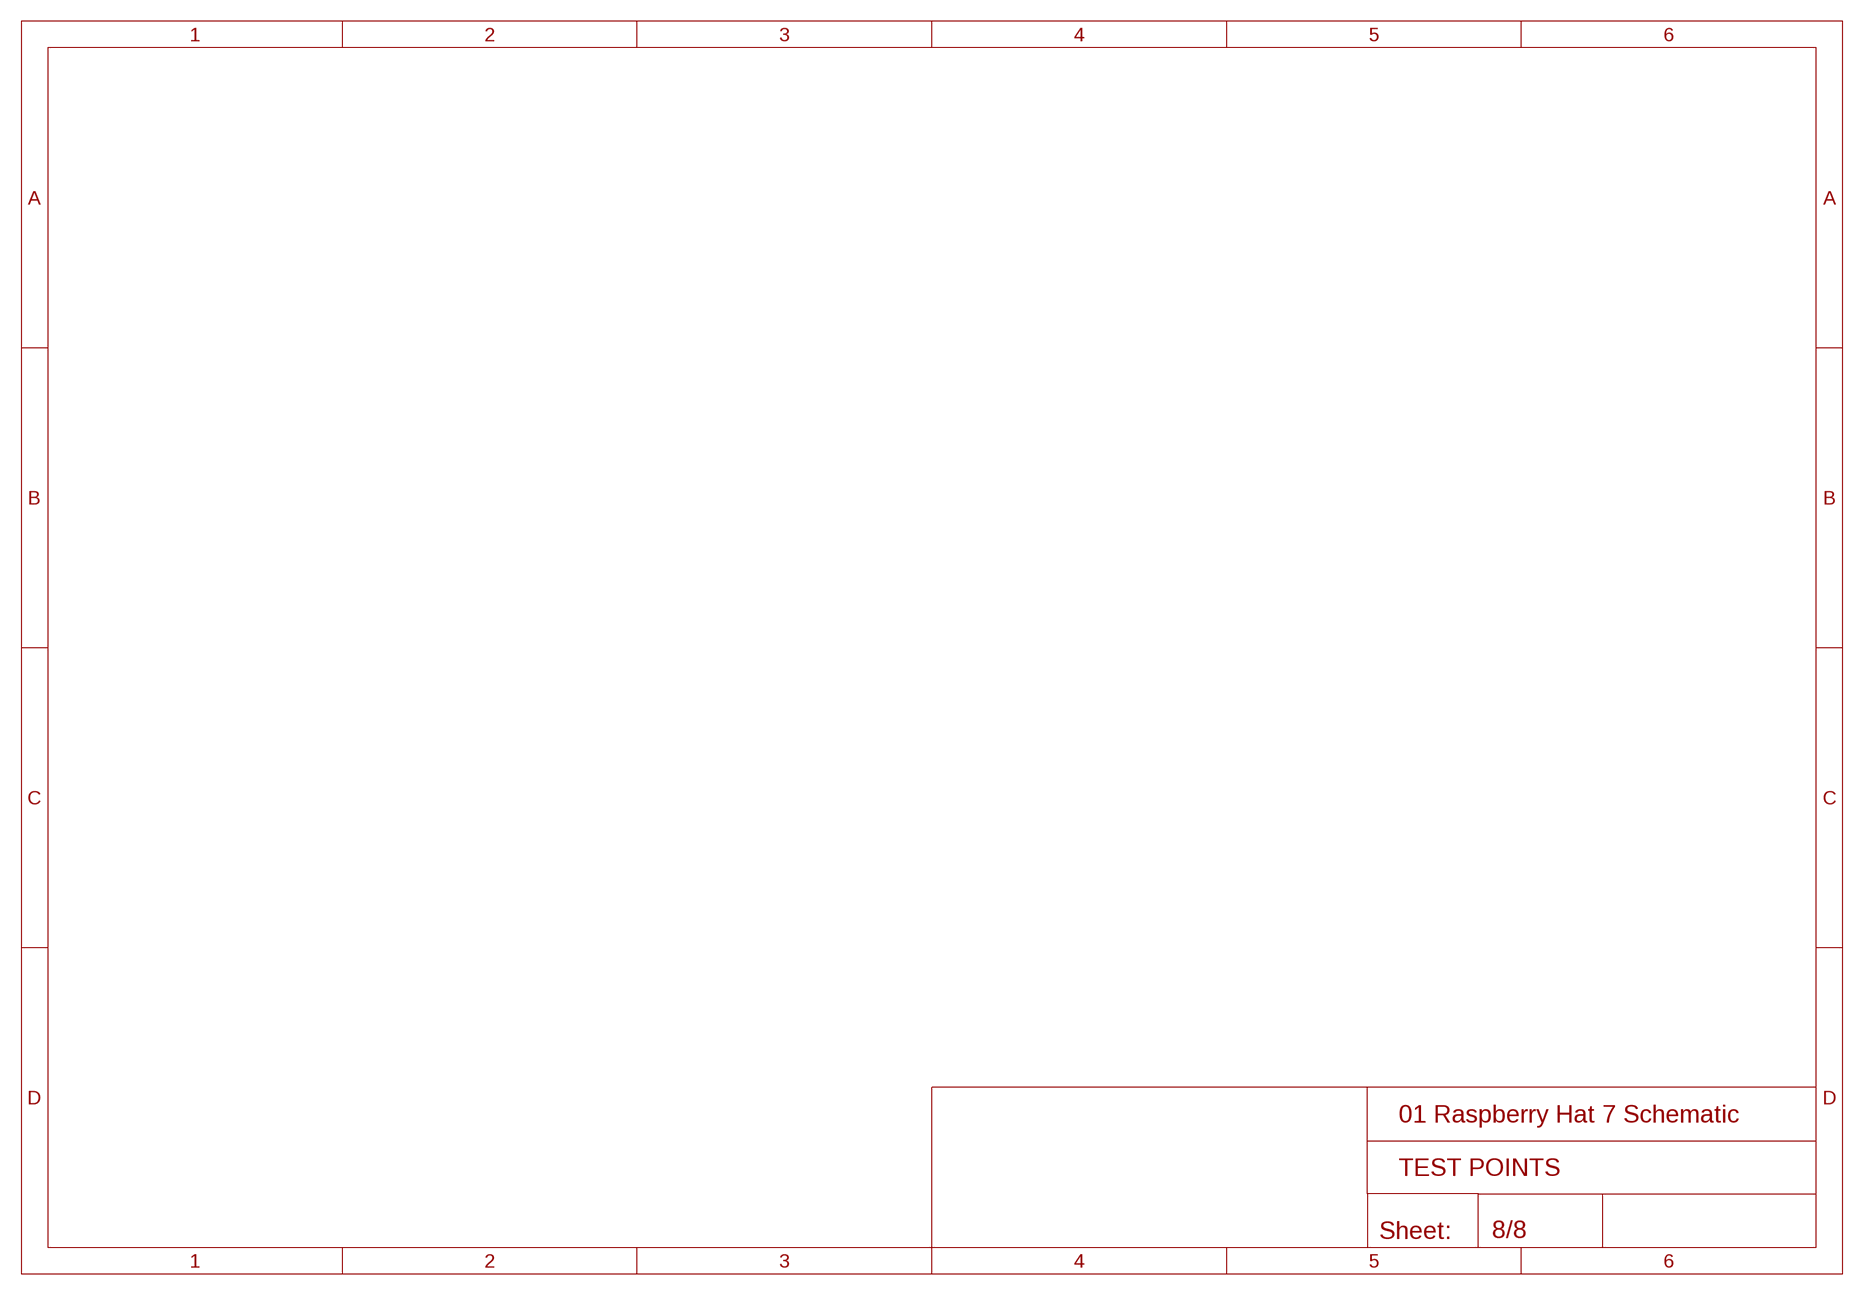
[diagram p7: schematic, sheet 8]

## Library data of the parts
C1-C4 C8-C15 C18 C19 C21-C23 C25-C28 = resistor:C-EU: CAPACITOR, European symbol
C5 = resistor:CPOL-EU: POLARIZED CAPACITOR, European symbol; LINK: http://www.tme.eu/pl/details/sc1e107m0806bvr/kondensatory-elektrolityczne-smd-85c/samwha/
C6 = rcl:C-EU: CAPACITOR, European symbol; SPICEPREFIX: C
C20 = resistor:C-EU: CAPACITOR, European symbol; LINK: http://www.tme.eu/pl/details/cl21a476mqynnng/kondensatory-mlcc-smd-0805/samsung/
D1 = diode:SUPPRESSOR-: Suppressor diode; LINK: http://www.tme.eu/pl/details/smbj5.0a-tr/diody-transil-smd-jednokierunkowe/st-microelectronics/
D2-D17 = diode:DIODE-: DIODE; LINK: http://www.tme.eu/pl/details/sk38sma-dio/diody-schottky-smd/diotec-semiconductor/sk38sma/
F1 = polyfuse-smd_10:?: Polyfuse Resettable PTC Source: http://www.littelfuse.com/products/resettable-ptcs.aspx; LINK: http://www.tme.eu/pl/details/sl125-33/bezpieczniki-polimerowe-smd/ece/; MF: Littelfuse; MPN: 2920L050; OC_FARNELL: 1822223; OC_NEWARK: 18M4790
F2 F3 = polyfuse-smd_10:?: Polyfuse Resettable PTC Source: http://www.littelfuse.com/products/resettable-ptcs.aspx; LINK: http://www.tme.eu/pl/details/sl075-33/bezpieczniki-polimerowe-smd/ece/; MF: Littelfuse; MPN: 2920L050; OC_FARNELL: 1822223; OC_NEWARK: 18M4790
JP1 = pinhead:PINHD-1X2: PIN HEADER
MOTOR_CONNECTOR = con-phoenix-350:1751303: MKDS 1/ 8-3,5 Printklemme Nennstrom: 10 A Bemessungsspannung: 160 V Raster: 3,5 mm Polzahl: 8 Montageart: Löten Anschlussart: Schraubanschluss Anschlussrichtung vom Leiter zur Platine: 0° Source: http://eshop.phoenixcontact.com .. .pdf; OC_FARNELL: unknown; OC_NEWARK: unknown
PCB1 = RASPBERRY_PI_Bplus-eagle5:RASPBERRY_PI_B+: Raspberry Pi B+ Basedon issue: Thursday, July 10, 2014 - Rev 1.2 LBR by Tim Rettmann 07-2014
Q1 = User-Submitted:MOSFET-PCHANNEL: Generic PMOSFET IRLML2244 - TRANS-11153 (SOT-23 -20V -4.3A) (1.Gate 2.Source 3.Drain) FQP27P06 - COM-10349 <http://www.sparkfun.com/products/10349> (TO-220 -60V -27A) (1.Gate 2.Source 3.Drain)
Q2 = crystal:CRYSTAL: CRYSTAL; LINK: YIC 49SLMT 8.00MHZ 20PF 30PPM; OC_FARNELL: unknown; OC_NEWARK: unknown
R1 R2 R45 R46 R59-R63 = resistor:R-EU_: RESISTOR, European symbol
R3 = rcl:R-EU_: RESISTOR, European symbol; SPICEPREFIX: R
R5-R8 = rcl:R-EU_: RESISTOR, European symbol; LINK: http://www.tme.eu/pl/details/cs2512-0r25-1%25-hp/rezystory-smd-2512/viking/cs12ftfsr250/; SPICEPREFIX: R
ST-LINK_V2 = con-harting-ml:ML6: HARTING; OC_FARNELL: unknown; OC_NEWARK: unknown
U1 = STM32F030:STM32F051C: STM32F051 in LQPF48 package. STM32F0-series Cortex-M0 microcontroller in a 48 lead package. Datasheet <http://www.st.com/web/en/resource/technical/document/datasheet/DM00039193.pdf> (DM00039193.pdf) .; FLASH: 64K
U2 U3 = Texas Instruments_By_element14_Batch_1:SN74LVC4245APWR: OCTAL BUS TRANSCEIVER AND 3.3-V TO 5-V SHIFTER WITH 3-STATE OUTPUTS; MPN: SN74LVC4245APWR; OC_FARNELL: 1470935; OC_NEWARK: 92B8894; PACKAGE: TSSOP-24; SUPPLIER: Texas Instruments
U4 = SparkFun-IC-Memory:EEPROM-I2C: I2C EEPROMs, 24LC256 and others 24LC256 Series 256 kb I2C 2 Wire (32 k x 8 Bit) 2.5 V Serial EEPROM SMD - SOIC-8 Datasheet SparkFun Products SparkFun UDB5 - PIC UAV Development Board <https://www.sparkfun.com/products/11703> (GPS-11703); PROD_ID: IC-09714
U$1-U$3 = MP1584:MP1584: MP1584-dc-brick-pcb Step down Input: 4.5V - 28V Ouput 0.8V - 25V max. 3A Cheap on ebay
U$11 U$12 = SparkFun-IC-Special-Function:L298_BRIDGE_DRIVER: Full-bridge power driver IC; PROD_ID: IC-09133
X2 = Simplex-Connectors:2508-: 3M (TM) Pak 100 4-Wall Header Source: 3M; MF: 3M; MPN: 2510-6002UB; OC_FARNELL: 9838244; OC_NEWARK: 46F4725
X3 = con-phoenix-381_l:MC2: Mini-Combicon 3.81mm horizontal 2-polig (ohne Gegenstecker)
X4 = con-3m:2510-: 3M (TM) Pak 100 4-Wall Header Source: 3M; MF: 3M; MPN: 2510-6002UB; OC_FARNELL: 9838244; OC_NEWARK: 46F4725

## Board
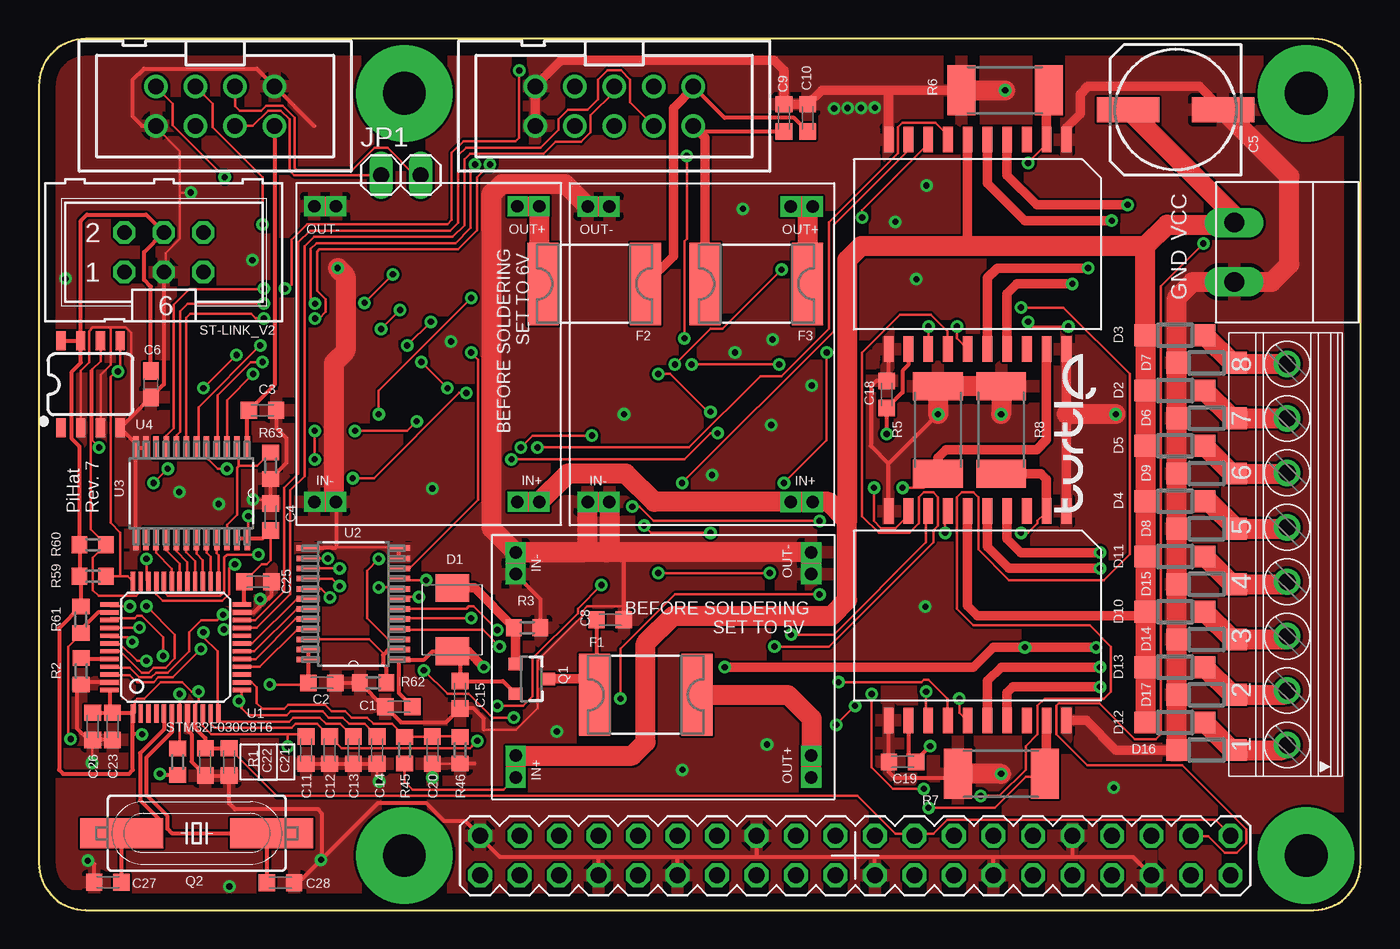
[diagram p8: board, top side]
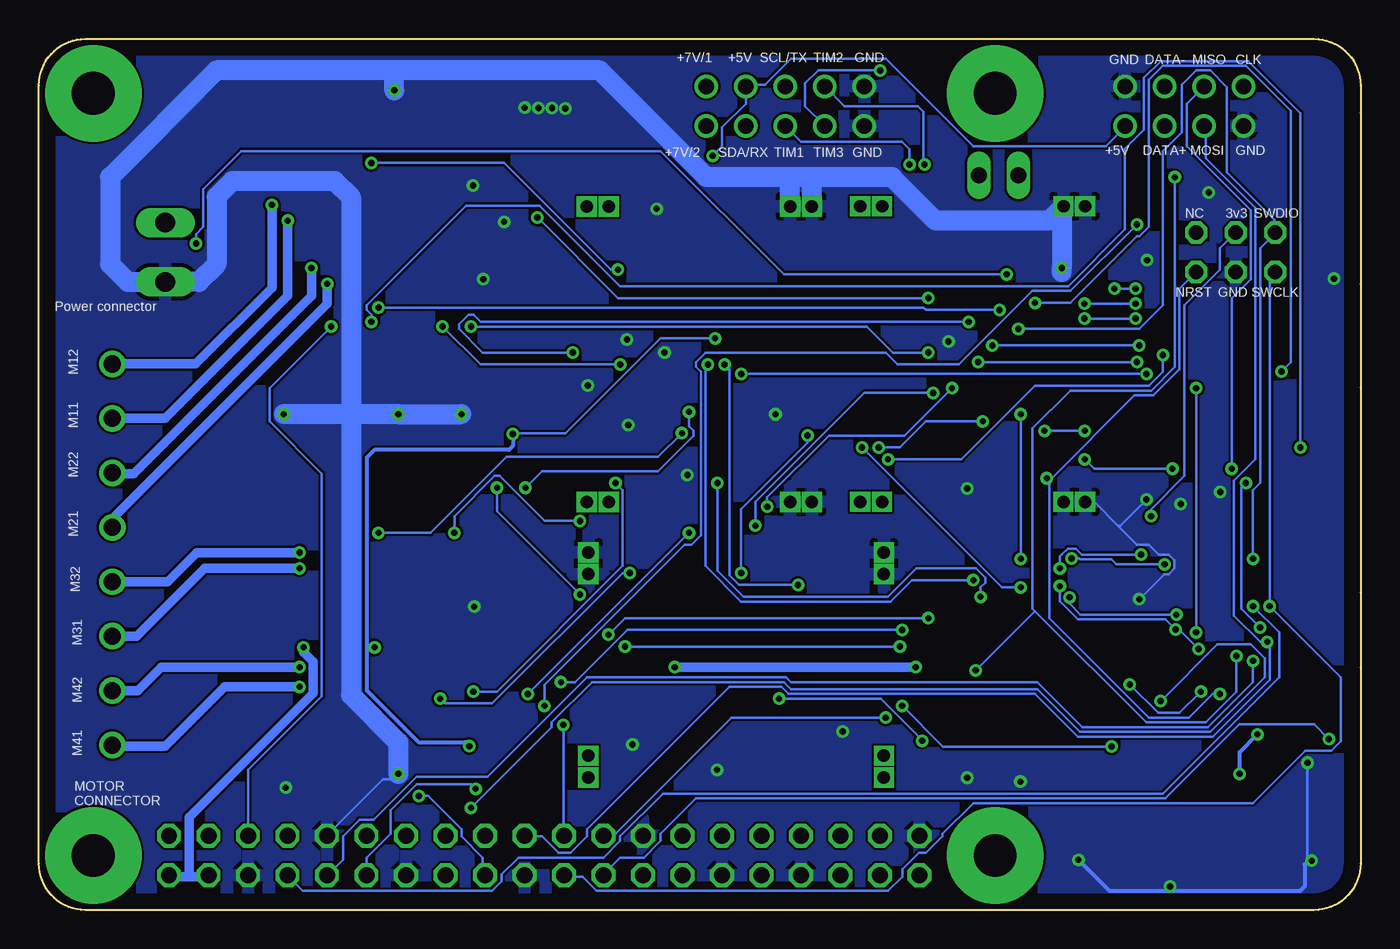
[diagram p9: board, bottom side, seen from below]

Size 85 x 56 mm. Coordinates in mm from the lower left corner, seen from the top.
Copper layers (1+16): Top 0.035mm / dielectric 1.5mm / Bottom 0.035mm
Design rules "default *": minimum track width 6mil, minimum drill 0.4mm, track to track 6mil, track to pad 6mil, pad to pad 6mil, via to via 6mil, smd to smd 6mil, copper to edge 40mil, drill to drill 6mil, minimum pad ring 10mil, minimum via ring 8mil, stop-mask expansion 4mil, vias tented up to drill 0mil, thermal gap 10mil

### Footprints (pad centres in the part's own frame; a part is rotated, then mirrored left to right if it is on the bottom)
C0603K = smd 1.05 x 1.08: 1 -0.875,0; 2 0.875,0
153CLV-0807 = smd 4 x 1.6: + 3.05,0; - -3.05,0
C0603 = smd 1.1 x 1: 1 -0.85,0; 2 0.85,0
SMBJ = smd 1.78 x 2.16: A 2.04,0; C -2.03,0
SOD123 = smd 1.4 x 1.4: A 1.9,0; C -1.9,0
2920L = smd 2 x 5.3: 1 -3.3,0; 2 3.3,0
1X02 = drill 1.016 long: 1 -1.27,0; 2 1.27,0
1751303 = drill 1.1 pad 1.7: 1 -12.25,-0.1; 2 -8.75,-0.1; 3 -5.25,-0.1; 4 -1.75,-0.1; 5 1.75,-0.1; 6 5.25,-0.1; 7 8.75,-0.1; 8 12.25,-0.1
RASPBERRY_PI_BPLUS_TPLACE = drill 1.016 octagon: 1 8.37,51.23; 2 8.37,53.77; 3 10.91,51.23; 4 10.91,53.77; 5 13.45,51.23; 6 13.45,53.77; 7 15.99,51.23; 8 15.99,53.77; 9 18.53,51.23; 10 18.53,53.77; 11 21.07,51.23; 12 21.07,53.77; 13 23.61,51.23; 14 23.61,53.77; 15 26.15,51.23; 16 26.15,53.77; 17 28.69,51.23; 18 28.69,53.77; 19 31.23,51.23; 20 31.23,53.77; 21 33.77,51.23; 22 33.77,53.77; 23 36.31,51.23; 24 36.31,53.77; 25 38.85,51.23; 26 38.85,53.77; 27 41.39,51.23; 28 41.39,53.77; 29 43.93,51.23; 30 43.93,53.77; 31 46.47,51.23; 32 46.47,53.77; 33 49.01,51.23; 34 49.01,53.77; 35 51.55,51.23; 36 51.55,53.77; 37 54.09,51.23; 38 54.09,53.77; 39 56.63,51.23; 40 56.63,53.77 | drill 2.75 pad 6.2: PE_BL 3.5,3.5; PE_BR 61.5,3.5; PE_TL 3.5,52.5; PE_TR 61.5,52.5
SOT23-3 = smd 0.8 x 0.9: 1 -0.95,-1; 2 0.95,-1; 3 0,1.1
HC49UP = smd 5.334 x 1.93: 1 -4.826,0; 2 4.826,0
R0603 = smd 1 x 1.1: 1 -0.85,0; 2 0.85,0
R2512 = smd 1.8 x 3.2: 1 -2.8,0; 2 2.8,0
ML6 = drill 0.914 octagon: 1 -2.54,-1.27; 2 -2.54,1.27; 3 0,-1.27; 4 0,1.27; 5 2.54,-1.27; 6 2.54,1.27
LQFP48 = smd 0.28 x 1.2: 1 -2.75,-4.25; 2 -2.25,-4.25; 3 -1.75,-4.25; 4 -1.25,-4.25; 5 -0.75,-4.25; 6 -0.25,-4.25; 7 0.25,-4.25; 8 0.75,-4.25; 9 1.25,-4.25; 10 1.75,-4.25; 11 2.25,-4.25; 12 2.75,-4.25; 25 2.75,4.25; 26 2.25,4.25; 27 1.75,4.25; 28 1.25,4.25; 29 0.75,4.25; 30 0.25,4.25; 31 -0.25,4.25; 32 -0.75,4.25; 33 -1.25,4.25; 34 -1.75,4.25; 35 -2.25,4.25; 36 -2.75,4.25 | smd 1.2 x 0.28: 13 4.25,-2.75; 14 4.25,-2.25; 15 4.25,-1.75; 16 4.25,-1.25; 17 4.25,-0.75; 18 4.25,-0.25; 19 4.25,0.25; 20 4.25,0.75; 21 4.25,1.25; 22 4.25,1.75; 23 4.25,2.25; 24 4.25,2.75; 37 -4.25,2.75; 38 -4.25,2.25; 39 -4.25,1.75; 40 -4.25,1.25; 41 -4.25,0.75; 42 -4.25,0.25; 43 -4.25,-0.25; 44 -4.25,-0.75; 45 -4.25,-1.25; 46 -4.25,-1.75; 47 -4.25,-2.25; 48 -4.25,-2.75
SOP65P640X120-24N = smd 1.473 x 0.356: 1 -2.921,3.581; 2 -2.921,2.921; 3 -2.921,2.286; 4 -2.921,1.626; 5 -2.921,0.965; 6 -2.921,0.33; 7 -2.921,-0.33; 8 -2.921,-0.965; 9 -2.921,-1.626; 10 -2.921,-2.286; 11 -2.921,-2.921; 12 -2.921,-3.581; 13 2.921,-3.581; 14 2.921,-2.921; 15 2.921,-2.286; 16 2.921,-1.626; 17 2.921,-0.965; 18 2.921,-0.33; 19 2.921,0.33; 20 2.921,0.965; 21 2.921,1.626; 22 2.921,2.286; 23 2.921,2.921; 24 2.921,3.581
SO08 = smd 0.6 x 1.2: 1 -1.905,-2.8; 2 -0.635,-2.8; 3 0.635,-2.8; 4 1.905,-2.8; 5 1.905,2.8; 6 0.635,2.8; 7 -0.635,2.8; 8 -1.905,2.8
DC-BRICK = drill 0.8 square: IN1+ 1.5,1.4; IN1- 1.5,14.47; IN2+ 1.5,2.8; IN2- 1.5,15.87; OUT1+ 20.5,1.4; OUT1- 20.5,14.47; OUT2+ 20.5,2.8; OUT2- 20.5,15.87
POWERSO20 = smd 1.651 x 0.635: 1 -6.731,5.715; 2 -6.731,4.445; 3 -6.731,3.175; 4 -6.731,1.905; 5 -6.731,0.635; 6 -6.731,-0.635; 7 -6.731,-1.905; 8 -6.731,-3.175; 9 -6.731,-4.445; 10 -6.731,-5.715; 11 6.731,-5.715; 12 6.731,-4.445; 13 6.731,-3.175; 14 6.731,-1.905; 15 6.731,-0.635; 16 6.731,0.635; 17 6.731,1.905; 18 6.731,3.175; 19 6.731,4.445; 20 6.731,5.715
PAK100/2500-10 = drill 1 pad 1.422: 1 -3.81,-1.27; 2 -3.81,1.27; 3 -1.27,-1.27; 4 -1.27,1.27; 5 1.27,-1.27; 6 1.27,1.27; 7 3.81,-1.27; 8 3.81,1.27
MC2 = drill 1.27 long: 1 -1.905,0; 2 1.905,0
PAK100/2500-10' = drill 1 pad 1.422: 1 -5.08,-1.27; 2 -5.08,1.27; 3 -2.54,-1.27; 4 -2.54,1.27; 5 0,-1.27; 6 0,1.27; 7 2.54,-1.27; 8 2.54,1.27; 9 5.08,-1.27; 10 5.08,1.27

### Placement (x,y rotation side)
C1  23.15,13.07 180 top
C2  18.2,14.6 0 top
C3  14.39,32.12 0 top
C4  14.9,25.27 90 top
C5  73.1,51.45 180 top
C6  7.2,33.8 270 top
C8  36.74,18.66 0 top
C9  49.44,50.92 90 top
C10  47.92,50.92 90 top
C11  17.18,10.28 270 top
C12  18.71,10.28 270 top
C13  20.23,10.28 270 top
C14  21.75,10.28 270 top
C15  27.09,13.84 270 top
C18  54.52,33.14 270 top
C19  55.54,9.52 0 top
C20  25.31,10.28 270 top
C21  12.23,9.52 270 top
C22  10.7,9.52 270 top
C23  4.74,11.8 270 top
C25  14.08,21.1 0 top
C26  3.47,11.8 270 top
C27  4.44,1.78 0 top
C28  15.54,1.75 180 top
D1  26.58,18.66 90 top
D2  73.06,33.39 0 top
D3  73.06,36.95 0 top
D4  73.06,26.28 0 top
D5  73.06,29.84 0 top
D6  75.09,31.62 180 top
D7  75.09,35.17 180 top
D8  75.09,24.5 180 top
D9  75.09,28.06 180 top
D10  73.06,19.17 0 top
D11  73.06,22.73 0 top
D12  73.06,12.06 0 top
D13  73.06,15.61 0 top
D14  75.09,17.39 180 top
D15  75.09,20.95 180 top
D16  75.09,10.28 180 top
D17  75.09,13.84 180 top
F1  39.03,13.84 0 top
F2  35.72,40.25 180 top
F3  46.14,40.25 180 top
JP1  23.28,47.24 0 top
MOTOR_CONNECTOR  80.17,22.85 90 top
PCB1  85,56 180 top
Q1  31.66,14.85 270 top
Q2  10.15,4.94 180 top
R1  8.93,9.52 270 top
R2  2.72,15.36 90 top
R3  31.41,18.15 180 top
R5  57.82,30.85 90 top
R6  62.14,52.7 180 top
R7  61.89,8.76 180 top
R8  61.89,30.85 90 top
R45  23.53,10.28 270 top
R46  27.09,10.28 90 top
R59  3.47,21.46 180 top
R60  3.47,23.49 180 top
R61  2.7,18.66 90 top
R62  21.5,14.6 180 top
R63  14.9,28.57 270 top
ST-LINK_V2  8.04,42.28 0 top
U1  8.8,16.88 0 top
U2  20.23,19.68 180 top
U3  9.82,26.79 270 top
U4  3.33,33.8 0 top
U$1  51.16,24.73 90 top
U$2  33.58,24.74 90 top
U$3  29.16,7.12 0 top
U$11  60.36,42.79 270 top
U$12  60.36,18.92 270 top
X2  11.34,51.68 180 top
X3  76.87,42.28 90 top
X4  2510-  [PAK100/2500-10']  36.99,51.68 180 top

### Tracks (layer width: path | path; a pad name or v marks a point on that pad's centre or on a via)
5V_NOT_TRIMMED
  Top 0.254: C8.1 35.86,14.85 | 35.86,14.85 35.86,13.97 F1.1 35.73,14.6 35.47,14.85 | Q1.3 35.47,14.85 | 35.47,14.85 35.86,14.85
  Top 0.61: Q1.3 35.86,14.85
+3V3  (via drill 0.4)
  Top 0.152: PCB1.1 76.57,4.89 75.65,5.81 58.43,5.81 57.52,4.89 56.45,4.89 PCB1.17 56.3,4.89 55.08,4.89 52.64,7.33 15.3,7.33 12.25,10.38 C21.1 | v14.84,14.5 17.28,14.5 C2.1 | U1.9 10.12,12.67 10.12,13.28 10.27,13.43 v10.27,14.04 9.82,14.04 9.21,14.65 7.83,14.65 6.77,13.58 6.31,13.58 6.16,13.43 6.16,12.67 U1.1 | v13.47,25.32 13.47,23.95 U3.24 | C25.1 14.33,22.22 14.64,22.22 14.9,22.47 C4.1 | R1.2 9.21,8.39 9.31,8.39
  Top 0.254: C4.1 14.37,23.87 U3.24 U3.23 | U4.8 U4.7 | U4.7 2.69,35.18 2.11,34.6 2.11,30.28 2.62,29.78 R60.2 R59.2 2.7,21.37 R61.2 1.31,18.11 1.31,9.01 1.56,8.76 5.8,8.76 6.05,9 6.05,11.3 | C6.1 7.2,40.07 6.77,40.51 6.77,42.28 ST-LINK_V2.4 6.89,44.7 3.08,44.7 2.69,44.3 U4.7 | C26.1 C23.1 | U1.48 4.55,12.87 C23.1 | C23.1 6,12.68 U1.1 6.05,11.3 | C22.1 C21.1 | C22.1 10.68,10.37 | C22.1 10.7,11.04 10.05,11.7 U1.9 | U2.23 U2.24 17.32,16.08 C2.1 | C25.1 13.21,19.79 U1.24 | R1.2 7.87,8.67 v7.78,8.76 | v6.64,11.3 6.05,11.3
  Bottom 0.152: v14.84,14.5 13.02,12.67 11.64,12.67 v10.27,14.04 | v13.47,25.32 13.47,25.77 11.34,27.91 11.34,38.88 9.05,41.17 9.05,42.54 ST-LINK_V2.4
  Bottom 0.254: v7.78,8.76 7.78,10.15 v6.64,11.3
+5V  (via drill 0.4)
  Top 0.152: v41.67,48.48 41.67,43.15 41.51,42.99 v41.51,36.75
  Top 0.254: U3.1 13.4,32.01 C3.1 15.15,33.76 X2.2 | C1.1 23.15,13.95 U2.1 24.78,16.1 25.31,16.63 D1.C 27.09,16.12 C15.1 29.85,14.71 Q1.2 | U$11.12 55.92,35.05 55.54,34.66 55.54,33.28 C18.2 v54.52,30.6 | U$12.12 55.92,10.01 C19.2 56.41,9.63 v57.31,10.53
  Top 0.61: D1.C 27.59,16.63 v28.61,15.61 | v67.98,16.88 v63.41,16.88 61.38,16.88 60.11,15.61 v44.11,15.61
  Bottom 0.152: X2.2 15.15,50.31 16.37,49.09 24.9,49.09 30.54,54.73 36.64,54.73 38.31,53.05 39.53,53.05 X4.3 39.53,51.83 41.06,50.31 41.06,49.09 v41.67,48.48 | v41.51,36.75 45.02,36.75 51.12,30.65 54.47,30.65 v54.52,30.6
  Bottom 0.254: v54.52,30.6 54.52,29.84 54.77,29.58 63.41,29.58 63.92,29.08 63.92,16.88 | 63.92,16.88 63.92,14.11 60.59,10.79 57.57,10.79 v57.31,10.53 | 63.92,16.88 v63.41,16.88
  Bottom 0.61: 75.35,2.15 75.35,5.96 67.38,13.93 67.38,15.97 67.98,16.58 v67.98,16.88 | 75.35,2.15 74.17,2.15 PCB1.4 | 75.35,2.15 76.55,2.15 PCB1.2 | v28.61,15.61 v44.11,15.61
+5V_RAW
  Top 1.27: F1.2 48.17,13.84 49.69,12.31 49.69,9.96 U$3.OUT2+ U$3.OUT1+
+7V/1
  Top 0.254: C9.1 48.56,50.92 44.11,50.92 42.14,52.89 X4.1
  Top 0.61: F2.1 40.8,42.03 40.8,51.55 42.14,52.89
+7V/1_RAW
  Top 1.27: U$2.OUT2+ U$2.OUT1+ 32.18,41 32.42,40.76 F2.2
+7V/2
  Top 0.254: C10.1 42.44,50.05 X4.2
  Top 0.61: F3.2 42.84,49.65 X4.2
+7V/2_RAW
  Top 1.27: U$1.OUT2+ U$1.OUT1+ 49.44,44.91 F3.1
BAT_MEAS
  Top 0.152: 25.28,11.13 R45.1 22.7,11.96 21.52,11.96 21.12,12.37 20.1,12.37 19.7,12.77 18.81,12.77 18.41,13.18 16.02,13.18 15.76,12.92 14.39,12.92 14.01,13.3 14.01,14.31 13.68,14.63 U1.14 | C20.1 27.06,11.15
  Top 0.254: 25.28,11.13 C20.1 | 27.06,11.15 R46.2
BOOT0
  Top 0.254: U1.44 2.8,16.13 R2.2
D1-R3
  Top 0.61: Q1.1 30.66,18.05 R3.2 28.01,20.7 D1.A
DATA+
  Top 0.152: X2.4 13.76,50.41 14.74,51.4 15.56,51.4 16.13,50.82 16.13,47.52 16.42,47.24 JP1.1
DATA-
  Top 0.152: JP1.2 24.17,47.24 22.42,48.99 21.6,48.99 20.15,47.54 16.62,47.54 16.44,47.73 16.44,50.95 15.68,51.7 14.62,51.7 14.3,51.39 13.03,51.39 13.02,51.4 12.9,51.4 12.61,51.68 X2.3
EN1  (via drill 0.4)
  Top 0.152: U2.3 22.46,17.39 21.09,18.76 21.09,21.81 v21.86,22.57 | v21.86,31.87 21.86,33.39 v27.8,39.34 | v52.94,44.52 52.94,44.98 57.06,49.09 57.06,49.4 U$11.8
  Bottom 0.152: v21.86,31.87 v21.86,22.57 | v27.8,39.34 47.76,39.34 v52.94,44.52
EN1_UC
  Top 0.152: U2.21 16.63,18.05 14.21,15.63 U1.16
EN2  (via drill 0.4)
  Top 0.152: v29.63,16.93 28.56,18 23.23,18 U2.4 | v47.31,16.93 50.81,16.93 57.52,23.64 57.52,24.4 57.82,24.71 57.82,26.54 57.52,26.84 56.91,26.84 56.6,26.54 56.6,24.86 55.99,24.25 54.01,24.25 52.94,25.32 52.94,35.83 55.38,38.27 57.36,38.27 58.43,37.2 58.43,36.14 U$11.14
  Bottom 0.152: v47.31,16.93 v29.63,16.93
EN2_UC
  Top 0.152: U2.20 16.51,18.71 13.93,16.13 U1.17
EN3  (via drill 0.4)
  Top 0.152: v27.8,18.76 23.23,18.76 U2.5 | v48.37,17.7 51.12,17.7 57.06,23.64 57.06,25.62 U$12.8
  Bottom 0.152: v27.8,18.76 47.31,18.76 v48.37,17.7
EN3_UC
  Top 0.152: U2.19 16.57,19.35 13.86,16.63 U1.18
EN4  (via drill 0.4)
  Top 0.152: v29.48,18 27.95,19.53 27.65,19.53 27.49,19.37 23.23,19.37 U2.6 | v51.42,14.65 56.75,14.65 56.91,14.8 57.21,14.8 58.43,13.58 58.43,12.21 U$12.14
  Bottom 0.152: v29.48,18 47.15,18 50.51,14.65 v51.42,14.65
EN4_UC
  Top 0.152: U2.18 16.6,20.01 13.73,17.13 U1.19
GND  (via drill 0.4)
  Top 0.152: U4.2 2.69,34.68 3.22,35.21 3.22,37.21 3.47,37.46 4.61,37.46 | 4.61,37.46 5.6,37.46 5.94,37.12 5.94,31.68 | 4.61,37.46 4.61,35.05 3.97,34.41 3.97,31.01 U4.3 | C20.2 27.06,9.4 R46.1 | U2.12 23.07,23.34 19.11,23.34 19.06,23.26 | v14.24,19.98 14.46,19.75 | v3.41,9.47 3.41,10.84 C26.2 | v13.78,26.38 14.84,26.38 C4.2 | 28.61,11.6 30.69,11.6 32.07,12.97 32.07,16.02 34.96,18.92 34.96,19.22 35.27,19.53 37.61,19.53 | 9.05,46.09 9.05,48.79 7.53,50.31 X2.8 | 9.05,46.09 9.05,43.15 8.14,42.23 8.14,41.01 ST-LINK_V2.3 | v9.76,46.12 9.08,46.12 9.05,46.09 | C14.2 21.75,8.38 v21.88,8.25
  Top 0.254: U3.12 6.23,30 U4.4 5.25,31 5.94,31.68 C6.2 8.04,33.79 ST-LINK_V2.3 | U3.12 U3.11 | C3.2 15.26,31 15.91,30.35 15.91,28.73 R63.2 C4.2 | U3.13 U3.12 | 17.71,50.39 X2.1 14.01,54.09 6.77,54.09 6.01,53.33 6.01,51.05 6.64,50.41 X2.8 | U1.8 9.55,11.56 9.82,11.3 9.82,9.53 C22.2 C21.2 12.23,6.85 12.61,6.47 17.94,6.47 18.2,6.22 18.2,3.22 v18.14,3.22 | C23.2 C26.2 3.2,10.93 2.45,11.68 2.45,14.24 R2.1 2.84,14.63 U1.47 | v18.14,3.22 16.67,1.75 C28.1 | v18.14,3.22 18.18,3.25 | C11.2 C12.2 C13.2 C14.2 21.87,9.4 | C27.1 3.56,2.95 3.34,3.17 v3.14,3.17 | C2.2 R62.2 22.17,13.07 C1.2 23.29,12.06 26.18,12.06 C15.2 27.96,12.96 28.61,12.31 28.61,11.6 | U1.23 13.84,19.13 14.46,19.75 14.96,20.25 C25.2 | U$11.11 54.65,34.14 C18.1 53.87,34.02 53.5,33.65 53.5,29.84 54.65,28.7 | U$12.11 54.65,9.53 C19.1 54.66,8.87 55.03,8.5 58.83,8.5 R7.2 | 35.98,3.42 29.63,3.42 28.37,4.68 PCB1.39 27.43,5.71 26.07,5.71 24.9,6.88 21.8,6.88 v18.14,3.22 | 35.98,3.42 41.06,3.42 | 41.06,3.42 46.14,3.42 | 46.14,3.42 53.76,3.42 | 53.76,3.42 61.38,3.42 | 61.38,3.42 66.46,3.42 | 66.46,3.42 70.36,3.42 PCB1.6 | PCB1.9 66.47,3.43 66.46,3.42 | PCB1.14 61.38,2.24 61.38,3.42 | PCB1.20 53.76,2.24 53.76,3.42 | PCB1.25 46.15,3.43 46.14,3.42 | PCB1.30 41.06,2.24 41.06,3.42 | PCB1.34 35.99,3.41 35.98,3.42 | R3.1 32.26,19.99 U$3.IN1- | C8.2 37.61,19.53 37.61,22.88 37.5,22.99 | U2.11 U2.12 | U2.13 18.27,23.26 18.3,23.28 18.86,23.28 18.88,23.26 19.06,23.26 19.11,23.31 U$2.IN1- | U$12.10 54.65,28.7 | 54.65,28.7 v57.82,31.87 | R46.1 28.02,9.43 | C20.2 v25.31,8.5
  Top 0.61: 54.77,52.7 50.34,52.7 C9.2 C10.2 47.92,53.97 47.27,54.62 33.58,54.62 X4.9 X4.10 | 54.77,52.7 R6.2 | U$11.10 54.65,52.57 54.77,52.7 | U$11.20 66.08,31.87 U$12.1 | U$11.1 66.08,50.28 66.97,51.17 66.97,52.44 67.47,52.95 74.64,52.95 C5.- | U$12.20 67.35,12.19 69.25,10.28 D16.A
  Top 1.27: C5.- 80.43,47.17 80.43,41.52 79.28,40.38 X3.1 74.2,40.38 73.19,39.37 D7.A D6.A D9.A D8.A D15.A D14.A D17.A D16.A | U$2.IN2- U$2.IN1- 18.96,26.39 18.96,35.17 19.72,35.93 19.72,40.76 v19.21,41.27 | U$3.OUT1- U$3.OUT2- 37.5,22.99 36.49,22.99 | U$3.IN2- U$3.IN1- | U$1.OUT1- U$1.OUT2- 33.83,46.68 29.8,46.68 29.21,46.09 29.12,46.09 29.12,24.53 U$3.IN2- | U$2.OUT2- U$2.OUT1- | U$3.IN2- 34.97,22.99 35.29,23.31 U$1.IN2- U$1.IN1- 36.69,23.19 36.49,22.99 | 36.49,22.99 U$3.IN2- | v61.89,31.87 R8.2 R5.2 v57.82,31.87 | v61.89,8.76 R7.2 | R6.2 v62.14,52.7 | v69.25,31.87 66.08,31.87
  Bottom 0.152: v61.89,8.76 62.39,8.4 62.85,8.4 66.36,4.89 PCB1.9 | 15.61,24.71 17.13,26.23 17.59,26.23 U$2.IN2- | v3.41,9.47 3.41,3.22 v3.14,3.17 | v13.78,26.38 15.45,24.71 15.61,24.71 | v14.24,19.98 12.63,21.59 12.35,21.59 11.98,21.96 11.98,22.48 12.35,22.85 12.99,22.85 13.62,23.48 14.38,23.48 15.61,24.71
  Bottom 0.254: v3.14,3.17 3.34,3.17 3.59,2.91 3.59,1.52 3.9,1.21 16.13,1.21 v18.14,3.22 | v25.31,8.5 25.56,8.5
  Bottom 1.27: 35.47,47.11 30.14,47.11 27.34,44.32 20.04,44.32 U$2.OUT1- 19.21,45.14 v19.21,41.27 19.21,41.01 | 35.47,47.11 36.74,47.11 | 36.74,47.11 42.07,47.11 48.93,53.97 62.14,53.97 | 62.14,53.97 73.57,53.97 80.43,47.11 80.43,41.52 79.28,40.38 X3.1 74.71,40.38 73.57,41.52 73.57,45.84 72.55,46.86 65.95,46.86 64.93,45.84 64.93,31.87 | U$1.OUT2- 35.29,46.93 35.47,47.11 | U$1.OUT1- 36.69,47.06 36.74,47.11 | v57.82,31.87 v61.89,31.87 64.93,31.87 | v61.89,8.76 61.89,10.79 64.93,13.84 64.93,31.87 | v62.14,52.7 62.14,53.97 | 64.93,31.87 v69.25,31.87
  other vias: 49.69,33.72 57.09,46.58 55.08,44.24 45.27,45.08 37.63,31.87 47.1,31.18 43.29,27.96 57.01,19.5 46.82,10.64 41.39,9.01 33.31,11.47 25.31,27.09 9.03,26.87 1.71,40.58 12.25,1.52 69.12,7.87 52.01,51.55 51.14,51.53 52.87,51.55 53.76,51.58 56.42,40.56 44.77,35.83 47.18,36.67 26.5,36.54 13.73,41.78 11.57,26.1
  pour Top: -1.36,59.56 86.27,59.56 88.81,57.02 88.81,-0.13 86.27,-2.67 -3.9,-2.67 -6.44,-0.13 -6.44,57.02 -3.9,59.56
  pour Bottom: -5.17,60.83 87.54,60.83 90.08,58.29 90.08,-0.13 86.27,-3.94 -5.17,-3.94 -7.71,-1.4 -7.71,58.29
IN11  (via drill 0.4)
  Top 0.152: v24.45,20.13 23.23,20.13 U2.7 | v41.36,27.45 51.12,37.2 51.12,44.06 55.84,48.79 55.84,49.4 U$11.9
  Bottom 0.152: v24.45,20.13 24.45,20.75 24.14,21.05 24.14,21.35 24.75,21.96 28.56,21.96 30.39,20.13 39.69,20.13 41.36,21.81 v41.36,27.45
IN11_UC  (via drill 0.4)
  Top 0.152: U2.17 18.16,20.64 v18.71,20.1 | U1.45 4.62,15.56 5.85,15.56 6.46,14.95 7.22,14.95 7.53,15.26 8.29,15.26 9.66,16.63 9.66,17.85 10.43,18.61 11.47,18.61 v11.85,18.99
  Bottom 0.152: v11.85,18.99 18.01,18.99 18.71,19.68 v18.71,20.1
IN12  (via drill 0.4)
  Top 0.152: v21.86,20.75 23.07,20.75 U2.8 | v32.07,29.74 41.82,29.74 46.39,34.31 47.76,34.31 50.81,37.36 50.81,44.21 55.23,48.63 55.23,50.31 55.54,50.62 57.67,50.62 58.43,49.85 58.43,49.55 U$11.7
  Bottom 0.152: v21.86,20.75 23.07,20.75 v32.07,29.74
IN12_UC  (via drill 0.4)
  Top 0.152: U2.16 18.86,21.3 v19.34,20.82 | 11.85,17.98 v11.89,18.03 | v10.43,16.78 8.6,14.95 7.68,14.95 7.38,14.65 6.31,14.65 5.85,15.11 4.63,15.11 U1.46
  Bottom 0.152: v19.34,20.82 19.34,19.84 18.19,18.68 12.55,18.68 v11.89,18.03 11.67,18.03 v10.43,16.78
IN21  (via drill 0.4)
  Top 0.152: v24.9,21.2 23.23,21.2 U2.9 | v47.61,35.07 v41.97,35.07 | v59.04,37.51 59.04,36.75 U$11.15
  Bottom 0.152: v24.9,21.2 28.87,21.2 30.24,19.83 39.84,19.83 42.12,22.12 42.12,34.92 v41.97,35.07 | v47.61,35.07 56.6,35.07 v59.04,37.51
IN21_UC  (via drill 0.4)
  Top 0.152: U2.15 v19.34,21.96 | U1.32 8.05,20.43 8.29,20.19 11.66,20.19 11.92,20.44 11.92,22.67 12.1,22.85 v14.12,22.85
  Bottom 0.152: v14.12,22.85 17.94,22.85 18.32,23.23 18.84,23.23 19.21,22.86 19.34,22.73 v19.34,21.96
IN22  (via drill 0.4)
  Top 0.152: U2.10 23.84,21.96 28.26,26.38 28.26,35.38 v27.8,35.83 | v57.21,37.51 57.21,36.14 U$11.13
  Bottom 0.152: v27.8,35.83 30.08,35.83 31.76,37.51 v57.21,37.51
IN22_UC  (via drill 0.4)
  Top 0.152: v18.58,22.6 U2.14 | v12.61,22.22 12.48,22.22 12.22,21.96 12.22,20.31 11.79,19.88 7.96,19.88 7.55,20.29 U1.33
  Bottom 0.152: v18.58,22.6 18.12,22.6 18.07,22.55 16.04,22.55 15.71,22.22 v12.61,22.22
IN31  (via drill 0.4)
  Top 0.152: U3.3 12.1,32.78 v13.78,34.46 | v39.84,34.46 40.6,34.46 43.04,32.02 v43.19,32.02 | v53.71,27.15 53.71,25.01 54.16,24.55 55.08,24.55 55.84,25.32 55.84,25.62 U$12.9
  Bottom 0.152: v39.84,34.46 v13.78,34.46 | v43.19,32.02 43.19,31.11 42.89,30.8 42.89,30.5 45.17,28.21 52.64,28.21 v53.71,27.15
IN31_UC
  Top 0.152: U3.21 11.44,22.93 11.55,22.82 U1.25
IN32  (via drill 0.4)
  Top 0.152: v14.39,35.22 13.63,35.22 11.49,33.09 11.49,29.74 U3.4 | v26.27,33.55 v24.6,35.22 | v38.16,25.93 38.62,25.93 39.53,25.01 v50.2,25.01 | v58.28,24.25 58.28,25.47 U$12.7
  Bottom 0.152: v24.6,35.22 v14.39,35.22 | v26.27,33.55 29.32,30.5 34.2,30.5 38.16,26.54 v38.16,25.93 | v50.2,25.01 52.49,25.01 55.38,27.91 55.69,27.91 58.28,25.32 v58.28,24.25
IN32_UC
  Top 0.152: U3.20 10.78,22.98 11.05,22.71 U1.26
IN41  (via drill 0.4)
  Top 0.152: v12.1,28.36 11.49,28.36 10.88,28.97 10.88,29.58 U3.5 | v17.74,30.8 v17.74,28.97 | v20.33,30.8 23.68,30.8 v24.29,31.41 | v31,29.74 31.76,30.5 v35.57,30.5 | v47,21.66 v39.84,21.66 | v59.19,13.58 59.19,12.67 59.65,12.21 U$12.15
  Bottom 0.152: v12.1,28.36 17.13,28.36 v17.74,28.97 | v20.33,30.8 v17.74,30.8 | v24.29,31.41 27.95,31.41 29.63,29.74 v31,29.74 | v35.57,30.5 35.57,30.04 39.84,25.77 v39.84,21.66 | v47,21.66 47.46,21.66 55.84,13.28 58.89,13.28 v59.19,13.58
IN41_UC
  Top 0.152: U3.19 10.15,22.9 10.55,22.5 U1.27
IN42  (via drill 0.4)
  Top 0.152: v14.24,36.29 10.27,32.33 10.27,29.74 U3.6 | v25.21,37.81 v23.68,36.29 | v50.66,35.83 50.66,30.19 v47.92,27.45 | v57.06,14.04 57.06,12.21 U$12.13
  Bottom 0.152: v23.68,36.29 v14.24,36.29 | v25.21,37.81 56.6,37.81 57.06,38.27 57.36,38.27 57.97,37.66 57.97,37.36 56.45,35.83 v50.66,35.83 | v47.92,27.45 47.46,26.99 47.46,22.12 55.54,14.04 v57.06,14.04
IN42_UC
  Top 0.152: U3.18 9.49,22.99 10.05,22.42 U1.28
MOT11  (via drill 0.4)
  Top 0.61: U$11.5 61,46.73 63.41,44.32 v69,44.32
  Top 1.27: D6.C 77.01,31.6 | 77.01,31.6 MOTOR_CONNECTOR.7 | D2.A 76.75,31.6 77.01,31.6
  Bottom 0.61: v69,44.32 69,39.49 76.88,31.6 MOTOR_CONNECTOR.7
MOT12  (via drill 0.4)
  Top 0.61: U$11.4 62.27,47.24 64.17,45.33 v70.01,45.33
  Top 1.27: D7.C 77.06,35.1 | 77.06,35.1 MOTOR_CONNECTOR.8 | D3.A 76.81,35.1 77.06,35.1
  Bottom 0.61: MOTOR_CONNECTOR.8 74.91,35.1 70.01,40 v70.01,45.33
MOT21  (via drill 0.4)
  Top 0.61: U$11.17 62.27,39.62 62.9,40.25 v66.46,40.25
  Top 1.27: MOTOR_CONNECTOR.5 80.17,24.5 D8.C 75.22,26.28 D4.A
  Bottom 0.61: v66.46,40.25 66.46,38.98 80.27,25.17 MOTOR_CONNECTOR.5
MOT22  (via drill 0.4)
  Top 0.61: U$11.16 61,40.63 61.63,41.27 v67.47,41.27
  Top 1.27: MOTOR_CONNECTOR.6 80.23,28.06 D9.C 76.74,28.06 D5.A
  Bottom 0.61: v67.47,41.27 67.47,39.49 78.9,28.06 80.23,28.06 MOTOR_CONNECTOR.6
MOT31  (via drill 0.4)
  Top 0.61: U$12.5 61,23.36 62.39,21.96 v68.24,21.96
  Top 1.27: MOTOR_CONNECTOR.3 80.06,17.39 D14.C 76.74,17.39 D10.A
  Bottom 0.61: v68.24,21.96 74.33,21.96 78.69,17.6 MOTOR_CONNECTOR.3
MOT32  (via drill 0.4)
  Top 0.61: U$12.4 62.27,23.87 63.16,22.98 v68.24,22.98
  Top 1.27: MOTOR_CONNECTOR.4 80.12,20.95 D15.C 76.74,20.95 D11.A
  Bottom 0.61: v68.24,22.98 74.84,22.98 76.72,21.1 MOTOR_CONNECTOR.4
MOT41  (via drill 0.4)
  Top 0.61: U$12.17 62.27,13.96 62.65,14.34 v68.24,14.34
  Top 1.27: MOTOR_CONNECTOR.1 79.95,10.28 D16.C 76.74,10.28 D12.A
  Bottom 0.61: v68.24,14.34 73.06,14.34 76.87,10.53 80.2,10.53 MOTOR_CONNECTOR.1
MOT42  (via drill 0.4)
  Top 0.61: U$12.16 61,14.72 61.89,15.61 v68.24,15.61
  Top 1.27: MOTOR_CONNECTOR.2 80.01,13.84 D17.C 76.74,13.84 D13.A
  Bottom 0.61: v68.24,15.61 77.13,15.61 78.64,14.1 MOTOR_CONNECTOR.2
N$1
  Top 0.152: U2.22 21.25,17.39 22.16,16.48 22.13,16.39
  Top 0.254: R62.1 22.35,15.59 22.13,15.8 22.13,16.39 22.5,16.76 U2.2
N$2
  Top 0.152: U3.22 12.1,24.76 12.74,25.39 12.74,28.44 12.86,28.57 | R63.1 14.05,28.57 12.86,28.57 | 12.86,28.57 12.86,29.58 U3.2 | 12.86,28.52 12.86,28.57
N$28
  Top 0.254: 14.77,4.94 8.56,4.94 8.27,5.22 8.27,6.02 6.92,7.37 6.92,9.81 8.1,10.98 8.22,11.11 8.55,11.44 U1.6 | 14.77,4.94 Q2.1 | C28.2 14.66,4.83 14.77,4.94
N$29
  Top 0.152: Q2.2 5.4,5.05 5.31,5.05
  Top 0.254: C27.2 5.31,5.05 5.31,5.07 5.44,5.2 7.02,5.2 7.69,5.87 6.51,7.05 6.51,10.09 8.05,11.63 U1.5
NRST  (via drill 0.4)
  Top 0.152: 9.05,10.49 U1.7 9.05,12.67 v9.05,13.89 | v56.91,7.79 54.93,7.79 53.55,9.16 v53.55,13.89 | v43.19,24.25 39.38,24.25 v38.92,24.71 | v27.49,33.24 27.04,33.24 21.55,27.75 v20.18,27.75
  Top 0.254: 9.05,10.49 R1.1
  Bottom 0.152: v9.05,13.89 9.51,13.89 11.03,12.36 13.63,12.36 20.03,18.76 20.03,27.6 | 20.03,27.6 14.54,33.09 13.32,33.09 11.64,34.77 11.64,39.95 ST-LINK_V2.5 | v56.91,7.79 57.21,8.1 60.72,8.1 62.39,6.42 62.39,4.89 63.92,3.37 63.92,2.3 PCB1.12 | v43.19,24.25 v53.55,13.89 | v38.92,24.71 38.92,26.23 31.91,33.24 v27.49,33.24 | 20.03,27.6 v20.18,27.75
RPI_CLK  (via drill 0.4)
  Top 0.152: v7.99,16.32 7.99,17.54 6.62,18.92 6.31,18.92 6.16,18.76 4.63,18.76 U1.39 | v11.95,47.11 8.6,50.46 8.6,51.83 7.53,52.9 X2.7 | v30.54,12.36 29.17,12.36 27.65,13.89 26.27,13.89 v24.75,15.41
  Bottom 0.152: v7.99,16.32 7.99,14.04 9.97,12.06 13.78,12.06 20.94,19.22 | 20.94,19.22 21.09,19.37 21.09,30.96 18.65,33.39 13.47,33.39 11.95,34.92 v11.95,47.11 | v30.54,12.36 40.45,12.36 47.92,4.89 48.68,4.89 PCB1.23 | 20.94,19.22 v24.75,15.41
RPI_MISO  (via drill 0.4)
  Top 0.152: v6.46,18.15 4.63,18.15 U1.40 | v8.29,28.36 v7.38,27.45 | v52.49,13.12 v51.27,11.91 | v14.39,44.06 14.39,47.11 11.19,50.31 11.19,51.83 X2.5
  Bottom 0.152: v6.46,18.15 7.68,19.37 7.68,27.15 v7.38,27.45 | v8.29,28.36 8.29,39.34 7.07,40.56 7.07,44.98 11.19,49.09 11.19,51.83 X2.5 | v51.27,11.91 51.27,4.89 PCB1.21 | v52.49,13.12 52.49,14.5 43.5,23.49 43.04,23.49 42.43,24.1 42.43,34.61 42.73,34.92 42.73,35.22 42.12,35.83 30.54,35.83 29.78,35.07 25.82,35.07 21.09,39.8 18.65,39.8 v14.39,44.06
RPI_MOSI  (via drill 0.4)
  Top 0.152: v6.01,17.24 5.7,17.54 4.63,17.54 U1.41
  Bottom 0.152: X2.6 9.97,50.31 9.97,48.33 6.77,45.13 6.77,28.97 8.14,27.6 8.14,18.92 6.46,17.24 v6.01,17.24 5.85,17.09 5.85,14.8 9.51,11.14 18.2,11.14 20.94,13.89 36.79,13.89 37.25,14.34 40.6,14.34 49.74,5.2 49.74,4.74 50.81,3.68 51.57,3.68 52.64,4.74 53.71,4.74 PCB1.19
RPI_RXD  (via drill 0.4)
  Top 0.152: v6.92,16.02 6.31,16.02 5.24,17.09 4.63,17.09 U1.42
  Bottom 0.152: v6.92,16.02 6.92,14.65 9.82,11.75 17.89,11.75 20.79,14.65 36.64,14.65 36.94,14.95 49.74,14.95 56.15,8.55 60.72,8.55 63.46,5.81 64.38,5.81 65.44,4.74 65.44,3.22 66.36,2.3 PCB1.10
RPI_TXD  (via drill 0.4)
  Top 0.152: v6.92,19.53 8.75,17.7 8.75,16.17 8.14,15.56 7.38,15.56 7.07,15.26 6.62,15.26 5.24,16.63 4.63,16.63 U1.43
  Bottom 0.152: v6.92,19.53 5.24,17.85 5.24,14.95 12.71,7.49 44.87,7.49 47.61,4.74 47.61,4.44 48.68,3.37 54.16,3.37 55.23,2.3 55.23,1.85 55.84,1.24 68.03,1.24 68.95,2.15 PCB1.8
SCL  (via drill 0.4)
  Top 0.152: U4.6 3.96,35.29 3.43,34.75 | 3.43,34.75 3.34,34.66 3.34,24.46 R60.1 3.47,22.64 3.47,20.57 3.85,20.19 6.26,20.19 6.55,20.48 U1.35 | v66.2,37.51 63.92,37.51 v63.61,37.81 | v3.87,29.74 3.41,30.19 3.41,34.77 3.43,34.75
  Bottom 0.152: v66.2,37.51 70.17,33.55 70.17,31.41 66.81,28.06 66.81,13.73 71.54,9.01 71.54,4.89 PCB1.5 | v63.61,37.81 63.61,38.27 63.92,38.58 63.92,38.88 57.52,45.28 52.79,45.28 47.61,40.1 18.81,40.1 15.15,43.76 15.15,48.94 13.93,50.16 13.93,53.51 12.86,54.58 7.22,54.58 3.87,51.23 v3.87,29.74
SCL_TX
  Top 0.152: X4.5 36.99,52.58 35.49,51.08 35.49,49.98 34.88,49.38 33.21,49.38 32.44,48.61 27.72,48.61 27.37,48.25 27.37,44.02 26.62,43.27 17.69,43.27 17.08,42.66 17.08,27.89 16.17,26.98 16.17,20.31 13.99,18.13 U1.21
SDA  (via drill 0.4)
  Top 0.152: U1.36 5.73,21.46 5.24,21.46 | 5.24,21.46 R59.1 | U4.5 5.23,34.91 4.94,34.61 | 4.94,34.61 4.61,34.28 4.61,24.88 5.24,24.25 5.24,21.46 | v74.89,42.84 72.15,40.1 72.15,11.3 71.84,10.99 70.47,10.99 68.19,13.28 65.59,13.28 65.44,13.12 65.44,11.3 67.42,9.31 73.52,9.31 77.63,5.2 77.63,4.29 77.02,3.68 76.26,3.68 75.2,4.74 74.13,4.74 PCB1.3 | v20.94,39.03 v22.77,40.86 | 4.94,34.61 v5.09,34.61
  Bottom 0.152: v74.89,42.84 74.89,43.45 74.43,43.91 74.43,46.35 71.99,48.79 45.02,48.79 37.1,40.86 v22.77,40.86 | v20.94,39.03 18.65,39.03 14.39,43.3 14.24,43.3 13.63,43.91 13.63,53.36 12.71,54.27 7.38,54.27 4.48,51.38 4.48,35.22 v5.09,34.61
SDA_RX
  Top 0.152: U1.22 13.92,18.63 15.77,20.48 15.77,27.15 16.67,28.06 16.67,42.92 17.44,43.68 26.45,43.68 26.96,44.19 26.96,48.51 27.47,49.02 32.28,49.02 33.42,50.16 33.42,50.84 34.03,51.45 35.28,51.45 35.96,52.12 35.96,53.38 36.57,53.98 37.42,53.98 38.03,53.38 38.03,51.92 X4.4
SEN1  (via drill 0.4)
  Top 0.152: U1.10 10.55,11.83 11.09,11.3 15.76,11.3 16.01,11.3 | 16.01,11.3 17.04,11.3 | v16.01,10.51 16.01,11.3 | v29.48,13.12 31.15,13.12 31.76,13.73 31.76,16.17 34.66,19.07 34.66,19.37 v36.18,20.9 | v40.91,35.07 43.19,37.36 43.95,37.36 v47.76,41.17 | v63.61,48.02 64.83,49.24 U$11.2
  Top 0.254: 17.04,11.3 C11.1
  Top 0.61: U$11.2 64.81,52.56
  Top 1.27: 64.81,52.56 R6.1
  Bottom 0.152: v16.01,10.51 26.86,10.51 v29.48,13.12 | v36.18,20.9 39.99,20.9 40.6,21.51 40.6,34.77 v40.91,35.07 | v47.76,41.17 48.22,41.17 55.08,48.02 v63.61,48.02
SEN2  (via drill 0.4)
  Top 0.152: U1.11 11.05,11.97 11.31,11.7 16.27,11.7 16.53,11.96 17.9,11.96 C12.1 19.46,10.4 27.73,10.4 27.87,10.54 27.87,10.55 v28.19,10.88 | v37.4,13.58 37.4,16.78 40.91,20.29 v50.2,20.29 | v55.54,27.15 56.91,27.15 57.67,27.91 R5.1
  Top 0.61: U$11.19 64.81,30.22 64.17,29.58 58.33,29.58 57.82,29.08 R5.1
  Bottom 0.152: v37.4,13.58 30.85,13.58 28.19,10.93 v28.19,10.88 | v50.2,20.29 55.54,25.62 v55.54,27.15
SEN3  (via drill 0.4)
  Top 0.152: 20.17,11.15 19.36,11.96 18.48,11.96 18.07,12.37 16.36,12.37 16.1,12.11 11.67,12.11 11.55,12.23 U1.12 11.49,12.69 11.49,16.63 10.58,17.54 v10.58,17.85 | v63.16,24.25 63.61,24.25 64.22,24.86 64.22,25.01 64.68,25.47 U$12.2 | v43.65,30.65 43.19,30.65 41.51,28.97 v30.39,28.97 | v10.58,33.55 v12.71,35.68
  Top 0.254: C13.1 20.17,11.15
  Top 0.61: U$12.2 64.81,27.68 64.43,28.06 64.42,28.05 R8.1
  Top 1.27: R8.1
  Bottom 0.152: v63.16,24.25 59.8,24.25 54.93,29.13 45.17,29.13 v43.65,30.65 | v30.39,28.97 25.67,28.97 20.94,33.7 13.63,33.7 12.71,34.61 v12.71,35.68 | v10.58,17.85 v10.58,33.55
SEN4  (via drill 0.4)
  Top 0.152: C14.1 20.95,11.96 19.94,11.96 19.53,12.37 18.64,12.37 18.24,12.77 16.19,12.77 15.93,12.51 13.5,12.51 13.05,12.96 13.05,13.43 | 13.05,13.43 U1.13 | v57.21,6.57 61.48,6.57 63.46,8.55 64.53,8.55 R7.1 | 13.05,13.43 v12.86,13.43
  Top 0.61: U$12.19 64.81,8.88 R7.1
  Bottom 0.152: v57.21,6.57 52.03,11.75 52.03,12.06 49.44,14.65 37.1,14.65 36.64,14.19 20.79,14.19 18.05,11.45 9.66,11.45 6.16,14.95 6.16,16.17 7.07,17.09 9.21,17.09 v12.86,13.43
SERVO1  (via drill 0.4)
  Top 0.152: v14.47,38.02 14.44,38.05 13.93,38.05 13.65,38.32 9.73,38.32 9.49,38.08 U3.7 | v29.01,47.93 28.18,47.1 28.18,43.68 26.96,42.46 18.03,42.46 17.89,42.33 17.89,39.82 18.45,39.27 18.45,38.45 18.02,38.02 v17.76,38.02
  Bottom 0.152: X4.6 35.98,49.4 29.5,49.4 29.01,48.9 v29.01,47.93 | v17.76,38.02 v14.47,38.02
SERVO1_UC
  Top 0.152: U3.17 8.85,23.05 9.55,22.35 U1.29
SERVO2  (via drill 0.4)
  Top 0.152: v28.05,47.93 27.77,47.65 27.77,43.85 26.79,42.87 17.86,42.87 17.49,42.5 17.49,39.26 v17.76,38.98 | v14.47,38.98 9.56,38.98 9.08,38.5 9.08,30.75 8.85,30.52 U3.8
  Bottom 0.152: v17.76,38.98 v14.47,38.98 | X4.7 33.18,51.68 28.48,51.68 28.1,51.3 28.1,47.98 v28.05,47.93
SERVO2_UC
  Top 0.152: U3.16 8.19,23.13 9.05,22.27 U1.30
SERVO3  (via drill 0.4)
  Top 0.152: U3.9 8.19,30.5 8.67,30.98 8.67,38.92 9.67,39.92 14.44,39.92 v14.47,39.94 | v30.9,53.97 30.88,53.95 30.88,49.66 30.64,49.42 27.3,49.42 26.55,48.67 26.55,44.36 26.28,44.09 17.27,44.09 16.27,43.09 16.27,40.2 16.01,39.94 v15.83,39.94
  Bottom 0.152: X4.8 35.72,51.68 35.72,53.14 34.88,53.98 30.91,53.98 | v14.47,39.94 v15.83,39.94
  Bottom 0.254: 30.91,53.98 v30.9,53.97
SERVO3_UC
  Top 0.152: U3.15 7.53,22.96 8.55,21.94 U1.31
SPI1_NSS  (via drill 0.4)
  Top 0.152: v2.04,10.99 1.89,11.14 1.89,16.93 2.65,17.7 R61.1
  Top 0.254: U1.38 3.81,19.13 2.7,18.03 R61.1
  Bottom 0.152: PCB1.24 48.68,2.3 47.61,3.37 46.09,3.37 45.02,4.44 45.02,4.89 42.73,7.18 12.56,7.18 7.81,11.93 2.98,11.93 v2.04,10.99
SWCLK  (via drill 0.4)
  Top 0.152: v5.85,19.53 4.63,19.53 U1.37
  Bottom 0.152: ST-LINK_V2.1 5.55,41.01 5.85,40.71 v5.85,19.53 1.28,14.95 1.28,10.84 1.89,10.23 3.57,10.23 6.92,6.88 24.9,6.88 26.88,4.89 26.88,4.74 27.95,3.68 28.41,3.68 29.48,2.61 29.48,2.15 30.39,1.24 49.13,1.24 50.05,2.15 51.12,2.15 PCB1.22
SWDIO  (via drill 0.4)
  Top 0.152: v6.92,22.57 6.92,21.2 U1.34 | v60.56,7.33 61.78,7.33 63.46,9.01 63.46,10.53 64.22,11.3 64.22,13.12 64.68,13.58 68.49,13.58 68.95,14.04 68.95,16.93 67.58,18.31 60.11,18.31 59.04,19.37 59.04,26.54 59.35,26.84 60.11,26.84 60.41,26.54 60.41,23.18 62.39,21.2 68.49,21.2 70.17,22.88 70.17,34.46 65.9,38.73 v63.16,38.73 | v22.01,37.36 v23.23,38.58
  Bottom 0.152: v6.92,22.57 6.92,26.99 6.46,27.45 6.46,42.54 5.55,43.45 ST-LINK_V2.2 5.55,43.6 5.55,44.37 8.6,47.41 8.6,52.9 9.66,53.97 10.58,53.97 11.49,53.05 11.49,50.01 12.71,48.79 12.71,38.88 14.24,37.36 v22.01,37.36 | v60.56,7.33 59.96,7.33 57.82,5.2 57.82,4.74 56.45,3.37 56.45,2.3 PCB1.18 | v63.16,38.73 28.1,38.73 27.95,38.58 v23.23,38.58
VCC
  Top 0.152: U$3.IN1+ 29.88,7.74 24.04,7.74 23.53,8.25 R45.2
  Top 0.61: U$11.6 59.73,42.8 59.6,42.67 | U$12.6 59.73,19.55 60.36,18.92 70.91,18.92 D10.C
  Top 1.27: C5.+ 76.87,44.62 | 76.87,44.62 X3.2 | D12.C D13.C D10.C D11.C D4.C D5.C D2.C D3.C 71.16,42.67 | 71.16,42.67 72.55,44.06 76.31,44.06 76.87,44.62 | U$3.IN1+ U$3.IN2+ 38.16,9.92 39.03,10.79 39.03,17.14 40.8,18.92 50.96,18.92 51.98,19.93 51.98,25.01 | U$2.IN2+ U$2.IN1+ 34,28.06 37.76,28.06 39.59,26.23 U$1.IN2+ | U$1.IN2+ U$1.IN1+ | U$1.IN2+ 50.76,26.23 51.98,25.01 | 51.98,25.01 51.98,41.78 52.87,42.67 59.6,42.67 71.16,42.67

### Text on the board
tPlace: BEFORE SOLDERING / SET TO 6V | BEFORE SOLDERING / SET TO 5V
tNames: VCC | GND | STM32F030C8T6
bNames: GND | TIM2 | SCL/TX | +5V | +7V/1 | CLK | MISO | DATA- | GND | GND | MOSI | DATA+ | +5V | GND | TIM3 | TIM1 | SDA/RX | +7V/2 | SWDIO | 3v3 | NC | SWCLK | GND | NRST | Power connector | M12 | M11 | M22 | M21 | M32 | M31 | M42 | M41 | MOTOR / CONNECTOR
_tNames: PiHat / Rev. 7